# EAGLE design Mic and Speaker for Home Assistant V2.0 (EAGLE 6.1)
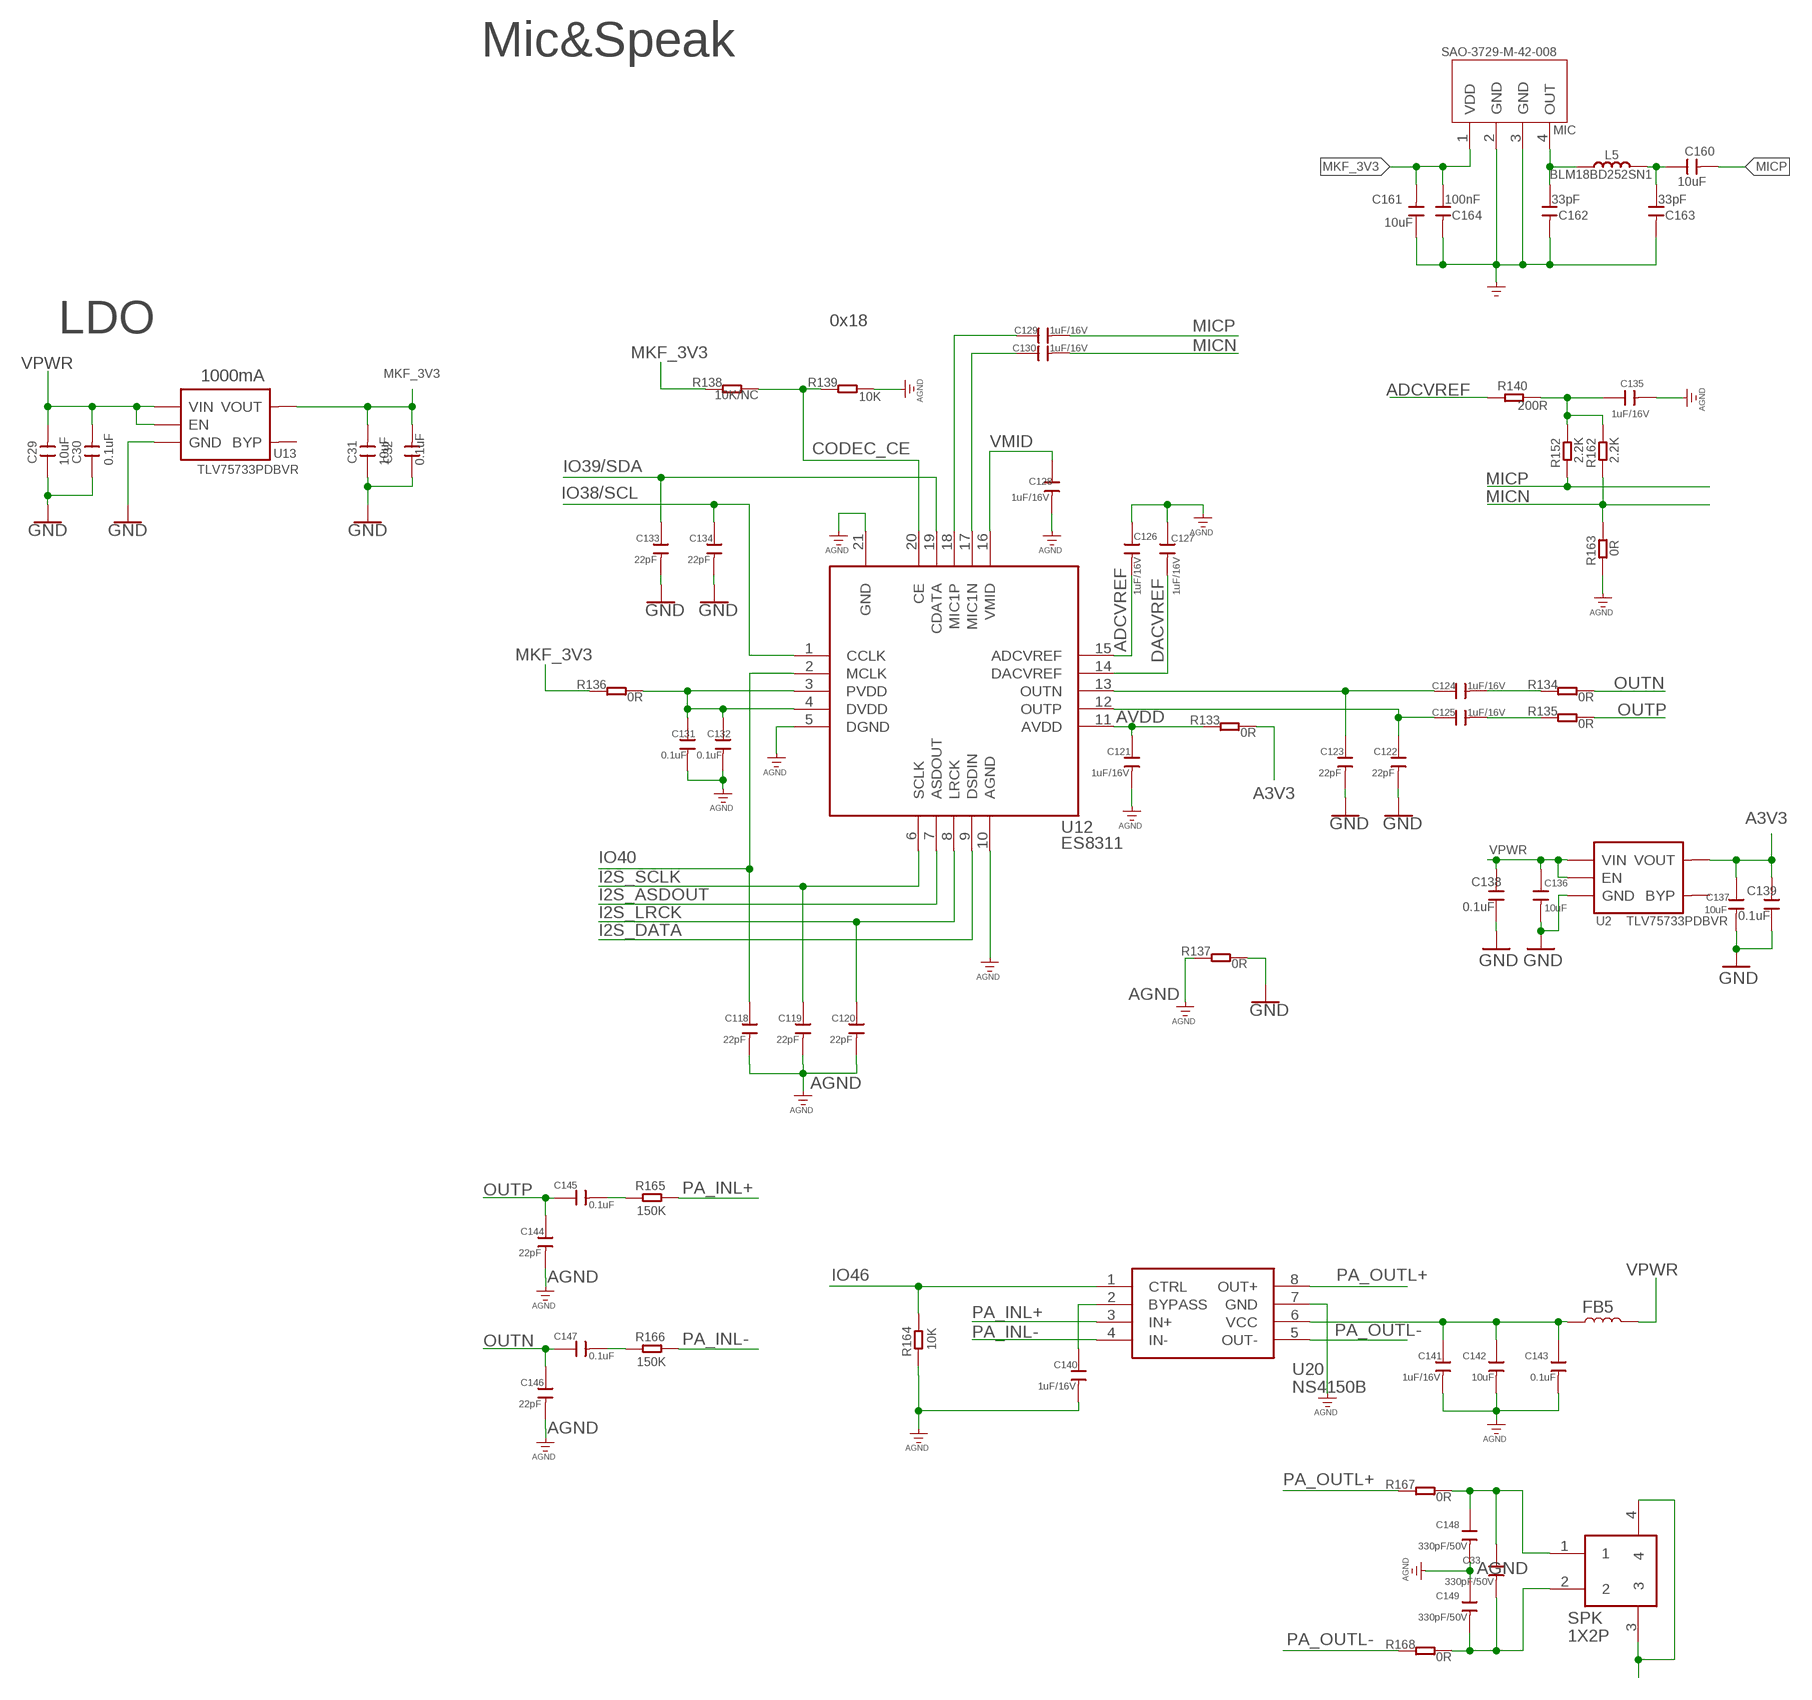
[diagram p0: schematic, sheet 1, part 1 of 2]
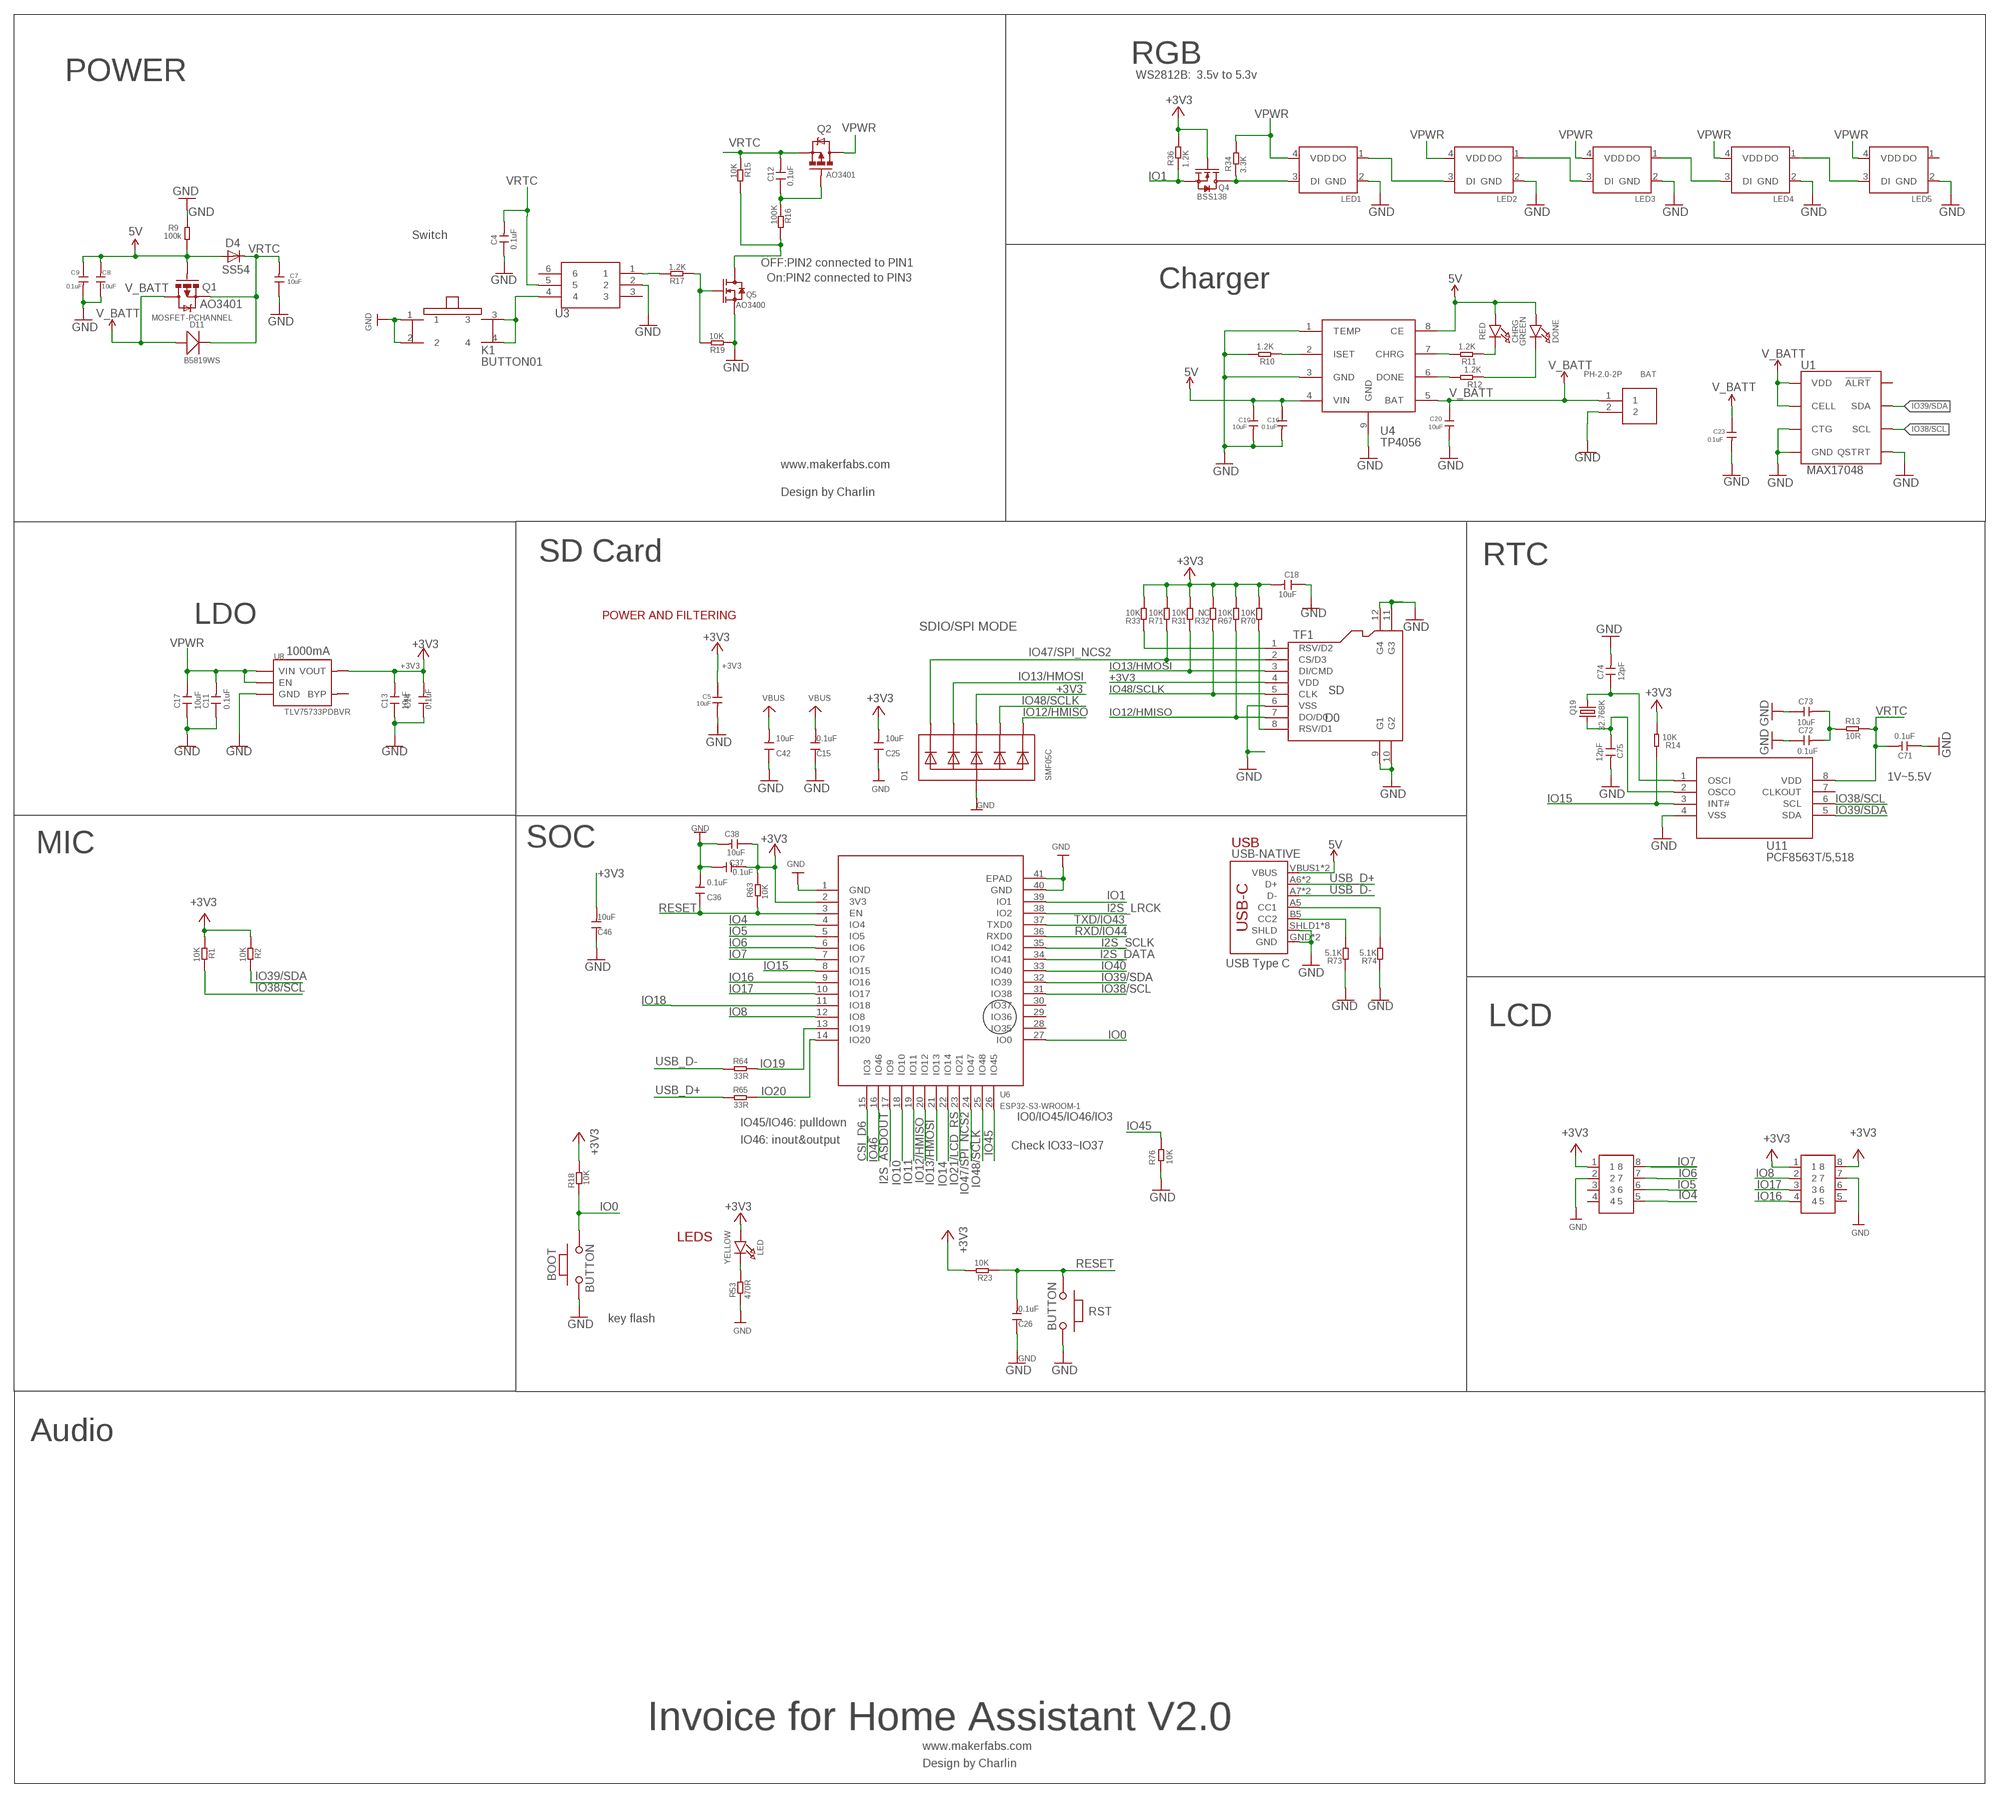
[diagram p1: schematic, sheet 1, part 2 of 2]

## Parts
BAT  PH-2.0-2P  [PH-2.0-2P]
BOOT  BUTTON  PB157  [157SW]
C4  0.1uF  DISCRETE_C-0603  [DISCRETE_C0603]
C5  10uF  C-0603  [C0603]
C7  10uF  C-0603  [C0603]
C8  10uF  C-0603  [C0603]
C9  0.1uF  C-0603  [C0603]
C10  10uF  C-0603  [C0603]
C11  0.1uF  DISCRETE_C-0603  [DISCRETE_C0603]
C12  0.1uF  DISCRETE_C-0603  [DISCRETE_C0603]
C13  10uF  DISCRETE_C-0603  [DISCRETE_C0603]
C14  0.1uF  DISCRETE_C-0603  [DISCRETE_C0603]
C15  0.1uF  DISCRETE_C-0603  [DISCRETE_C0603]
C16  0.1uF  C-0603  [C0603]
C17  10uF  DISCRETE_C-0603  [DISCRETE_C0603]
C18  10uF  DISCRETE_C-0603  [DISCRETE_C0603]
C20  10uF  C-0603  [C0603]
C23  0.1uF  C-0603  [C0603]
C25  10uF  DISCRETE_C-0603  [DISCRETE_C0603]
C26  0.1uF  DISCRETE_C-0603  [DISCRETE_C0603]
C29  10uF  DISCRETE_C-0603  [DISCRETE_C0603]
C30  0.1uF  DISCRETE_C-0603  [DISCRETE_C0603]
C31  10uF  DISCRETE_C-0603  [DISCRETE_C0603]
C32  0.1uF  DISCRETE_C-0603  [DISCRETE_C0603]
C33  330pF/50V  C-0603  [C0603]
C36  0.1uF  DISCRETE_C-0603  [DISCRETE_C0603]
C37  0.1uF  DISCRETE_C-0603  [DISCRETE_C0603]
C38  10uF  DISCRETE_C-0603  [DISCRETE_C0603]
C42  10uF  DISCRETE_C-0603  [DISCRETE_C0603]
C46  10uF  DISCRETE_C-0603  [DISCRETE_C0603]
C71  0.1uF  DISCRETE_C-0603  [DISCRETE_C0603]
C72  0.1uF  DISCRETE_C-0603  [DISCRETE_C0603]
C73  10uF  DISCRETE_C-0603  [DISCRETE_C0603]
C74  12pF  DISCRETE_C-0603  [DISCRETE_C0603]
C75  12pF  DISCRETE_C-0603  [DISCRETE_C0603]
C118  22pF  C-0603  [C0603]
C119  22pF  C-0603  [C0603]
C120  22pF  C-0603  [C0603]
C121  1uF/16V  C-0603  [C0603]
C122  22pF  C-0603  [C0603]
C123  22pF  C-0603  [C0603]
C124  1uF/16V  C-0603  [C0603]
C125  1uF/16V  C-0603  [C0603]
C126  1uF/16V  C-0603  [C0603]
C127  1uF/16V  C-0603  [C0603]
C128  1uF/16V  C-0603  [C0603]
C129  1uF/16V  C-0603  [C0603]
C130  1uF/16V  C-0603  [C0603]
C131  0.1uF  C-0603  [C0603]
C132  0.1uF  C-0603  [C0603]
C133  22pF  C-0603  [C0603]
C134  22pF  C-0603  [C0603]
C135  1uF/16V  C-0603  [C0603]
C136  10uF  C-0603  [C0603]
C137  10uF  C-0603  [C0603]
C138  0.1uF  C-0603  [C0603]
C139  0.1uF  C-0603  [C0603]
C140  1uF/16V  C-0603  [C0603]
C141  1uF/16V  C-0603  [C0603]
C142  10uF  C-0603  [C0603]
C143  0.1uF  C-0603  [C0603]
C144  22pF  C-0603  [C0603]
C145  0.1uF  C-0603  [C0603]
C146  22pF  C-0603  [C0603]
C147  0.1uF  C-0603  [C0603]
C148  330pF/50V  C-0603  [C0603]
C149  330pF/50V  C-0603  [C0603]
C160  10uF  CAP-0603  [C0603]
C161  10uF  CAP-0603  [C0603]
C162  33pF  CAP-0603  [C0603]
C163  33pF  CAP-0603  [C0603]
C164  100nF  CAP-0603  [C0603]
CHRG  RED  LED0805_NOOUTLINE  [CHIPLED_0805_NOOUTLINE]
D1  SMF05C  TVSARRAY_5LANE  [SOT363]
D4  SS54  DIODE-DO-214AC  [DO-214AC]
D11  B5819WS  D'0805'  [SOD323]
DONE  GREEN  LED0805_NOOUTLINE  [CHIPLED_0805_NOOUTLINE]
FB5  INDUCTORFB-30OHM  [0603]
J1  CON2X4-254P-B  [CON2X4-2.54MM-THD]
J2  CON2X4-254P-B  [CON2X4-2.54MM-THD]
K1  BUTTON01  [BUTTON01]
L5  BLM18BD252SN1  INDUCTOR/FERRITE-BEAD'0603'  [L0603]
LED  YELLOW  LED0805_NOOUTLINE  [CHIPLED_0805_NOOUTLINE]
LED1  WS2812B-2020  [WS2812B-2020]
LED2  WS2812B-2020  [WS2812B-2020]
LED3  WS2812B-2020  [WS2812B-2020]
LED4  WS2812B-2020  [WS2812B-2020]
LED5  WS2812B-2020  [WS2812B-2020]
MIC  SAO-3729-M-42-008  MIC-MSM421A3729H8-C  [MIC4-SMD-3.76X2.95MM]
Q1  MOSFET-PCHANNEL  [SOT23-3]
Q2  AO3401  MOSFET-PCHANNEL  [SOT23-3]
Q4  BSS138  MOSFET-N'SOT23'  [SOT23@1]
Q5  AO3400  MOSFET-N'SOT23'  [SOT23@1]
Q19  32.768K  CRYSTAL_3215  [XTAL3215]
R1  10K  R-0603  [R0603]
R2  10K  R-0603  [R0603]
R9  100k  R-0603  [R0603]
R10  1.2K  R-0603  [R0603]
R11  1.2K  R-0603  [R0603]
R12  1.2K  R-0603  [R0603]
R13  10R  R-0603  [R0603]
R14  10K  R-0603  [R0603]
R15  10K  R-0603  [R0603]
R16  100K  R-0603  [R0603]
R17  1.2K  R-0603  [R0603]
R18  10K  R-0603  [R0603]
R19  10K  R-0603  [R0603]
R23  10K  R-0603  [R0603]
R31  10K  DISCRETE_R-0603  [DISCRETE_R0603]
R32  NC  DISCRETE_R-0603  [DISCRETE_R0603]
R33  10K  DISCRETE_R-0603  [DISCRETE_R0603]
R34  3.3K  R-0603  [R0603]
R36  1.2K  R-0603  [R0603]
R53  470R  R-0603  [R0603]
R63  10K  R-0603  [R0603]
R64  33R  R-0603  [R0603]
R65  33R  R-0603  [R0603]
R67  10K  DISCRETE_R-0603  [DISCRETE_R0603]
R70  10K  DISCRETE_R-0603  [DISCRETE_R0603]
R71  10K  DISCRETE_R-0603  [DISCRETE_R0603]
R73  5.1K  DISCRETE_R-0603  [DISCRETE_R0603]
R74  5.1K  DISCRETE_R-0603  [DISCRETE_R0603]
R76  10K  R-0603  [R0603]
R133  0R  R-0603  [R0603]
R134  0R  R-0603  [R0603]
R135  0R  R-0603  [R0603]
R136  0R  R-0603  [R0603]
R137  0R  R-0603  [R0603]
R138  10K/NC  R-0603  [R0603]
R139  10K  R-0603  [R0603]
R140  200R  R-0603  [R0603]
R152  2.2K  R-0603  [R0603]
R162  2.2K  R-0603  [R0603]
R163  0R  R-0603  [R0603]
R164  10K  R-0603  [R0603]
R165  150K  R-0603  [R0603]
R166  150K  R-0603  [R0603]
R167  0R  R-0603  [R0603]
R168  0R  R-0603  [R0603]
RST  BUTTON  PB157  [157SW]
SPK  1X2P  [1X2P-SMT1.25MM]
TF1  SD  HOLDER-MICROSD-8P  [8P-SMD]
U1  MAX17048  MAX17048DFN8  [DFN-8]
U2  TLV75733PDBVR  SPX3819  [SOT23-5]
U3  SW01A  [SOT23-6-95P-300L300W]
U4  TP4056  [SOP8-1.27P]
U6  ESP32-S3-WROOM-1  [ESP32-S3-WROOM-1]
U8  TLV75733PDBVR  SPX3819  [SOT23-5]
U11  PCF8563T/5,518  [SOP8]
U12  ES8311  [QFN20-40P-300L300W55H]
U13  TLV75733PDBVR  SPX3819  [SOT23-5]
U20  NS4150B  [MSOP8-65P-490L300W110H]
USB-NATIVE  USB_C5  [USB-C-16P-5]

## Nets
5V: C8.2 C9.1 C10.1 C16.1 CHRG.A D4.A DONE.A Q1.1(G) R9.1 U4.4(VIN) U4.8(CE) USB-NATIVE.VBUS1(VBUS) USB-NATIVE.VBUS2(VBUS)
+3V3: C5.1 C13.2 C14.2 C18.2 C25.2 C37.1 C38.1 C46.2 D1.4(C3) J1.1 J2.1 J2.8 LED.A Q4.1(G) R1.1 R2.1 R14.1 R18.2 R23.2 R31.2 R32.2 R33.2 R36.2 R63.2 R67.2 R70.2 R71.2 TF1.4(VDD) U6.2(3V3) U8.5(VOUT)
A3V3: C137.1 C139.2 R133.2 U2.5(VOUT)
ADCVREF: C126.2 R140.1 U12.15(ADCVREF)
AGND: C118.2 C119.2 C120.2 C121.2 C126.1 C127.1 C128.2 C131.2 C132.2 C135.2 C140.2 C141.2 C142.2 C143.2 C144.2 C146.2 C148.2 C149.1 C161.1 C162.2 C163.2 C164.2 MIC.2(GND) MIC.3(GND) R137.1 R139.2 R163.1 R164.1 U12.5(DGND) U12.10(AGND) U12.21(GND) U20.7(GND) ; supply symbol labelled GND_POWER
AVDD: C121.1 R133.1 U12.11(AVDD)
CODEC_CE: R138.2 R139.1 U12.20(CE)
CSI_D6: U6.15(IO3)
DACVREF: C127.2 U12.14(DACVREF)
GND: BAT.2 BOOT.1 C4.1 C5.2 C7.1 C8.1 C9.2 C10.2 C11.1 C13.1 C14.1 C15.1 C16.2 C17.1 C18.1 C20.2 C23.2 C25.1 C26.1 C29.1 C30.1 C31.1 C32.1 C36.2 C37.2 C38.2 C42.1 C46.1 C71.1 C72.1 C73.1 C74.2 C75.2 C122.2 C123.2 C133.2 C134.2 C136.2 C137.2 C138.1 C139.1 D1.2(A) J1.2 J2.7 K1.1 K1.2 LED1.2(GND) LED2.2(GND) LED3.2(GND) LED4.2(GND) LED5.2(GND) Q5.2(S) R9.2 R10.2 R19.1 R53.1 R73.1 R74.1 R76.1 R137.2 RST.1 SPK.3 SPK.4 TF1.6(VSS) TF1.9(G1) TF1.10(G2) TF1.11(G3) TF1.12(G4) U1.1(CTG) U1.4(GND) U1.6(QSTRT) U1.9(GND) U2.2(GND) U3.2 U4.1(TEMP) U4.3(GND) U4.9(GND) U6.1(GND) U6.40(GND) U6.41(EPAD) U8.2(GND) U11.4(VSS) U13.2(GND) USB-NATIVE.GND USB-NATIVE.GND2(GND) USB-NATIVE.SHLD1(SHLD) USB-NATIVE.SHLD2(SHLD) USB-NATIVE.SHLD3(SHLD) USB-NATIVE.SHLD4(SHLD) USB-NATIVE.SHLD5(SHLD) USB-NATIVE.SHLD6(SHLD) USB-NATIVE.SHLD7(SHLD) USB-NATIVE.SHLD8(SHLD)
I2S_ASDOUT: U6.17(IO9) U12.7(ASDOUT)
I2S_DATA: U6.34(IO41) U12.9(DSDIN)
I2S_LRCK: C120.1 U6.38(IO2) U12.8(LRCK)
I2S_SCLK: C119.1 U6.35(IO42) U12.6(SCLK)
IO0: BOOT.2 R18.1 U6.27(IO0)
IO1: Q4.2(S) R36.1 U6.39(IO1)
IO4: J1.5 U6.4(IO4)
IO5: J1.6 U6.5(IO5)
IO6: J1.7 U6.6(IO6)
IO7: J1.8 U6.7(IO7)
IO8: J2.2 U6.12(IO8)
IO10: U6.18(IO10)
IO11: U6.19(IO11)
IO12/HMISO: D1.6(C5) R67.1 TF1.7(DO/D0) U6.20(IO12)
IO13/HMOSI: D1.3(C2) R31.1 TF1.3(DI/CMD) U6.21(IO13)
IO14: U6.22(IO14)
IO15: R14.2 U6.8(IO15) U11.3(INT#)
IO16: J2.4 U6.9(IO16)
IO17: J2.3 U6.10(IO17)
IO18: U6.11(IO18)
IO19: R64.2 U6.13(IO19)
IO20: R65.2 U6.14(IO20)
IO21/LCD_RS: U6.23(IO21)
IO38/SCL: C134.1 R1.2 U1.7(SCL) U6.31(IO38) U11.6(SCL) U12.1(CCLK)
IO39/SDA: C133.1 R2.2 U1.8(SDA) U6.32(IO39) U11.5(SDA) U12.19(CDATA)
IO40: C118.1 U6.33(IO40) U12.2(MCLK)
IO45: R76.2 U6.26(IO45)
IO46: R164.2 U6.16(IO46) U20.1(CTRL)
IO47/SPI_NCS2: D1.1(C1) R71.1 TF1.2(CS/D3) U6.24(IO47)
IO48/SCLK: D1.5(C4) R32.1 TF1.5(CLK) U6.25(IO48)
MICN: C130.2 R162.1 R163.2
MICP: C129.2 C160.2 R152.1
MKF_3V3: C31.2 C32.2 C161.2 C164.1 MIC.1(VDD) R136.1 R138.1 U13.5(VOUT)
N$2: R10.1 U4.2(ISET)
N$3: R11.2 U4.7(CHRG)
N$4: R12.2 U4.6(DONE)
N$5: C12.1 Q2.1(G) R16.1
N$6: CHRG.C R11.1
N$7: DONE.C R12.1
N$8: Q5.3(D) R15.2 R16.2
N$12: LED.C R53.2
N$14: LED1.3(DI) Q4.3(D) R34.1
N$15: R33.1 TF1.1(RSV/D2)
N$16: R70.1 TF1.8(RSV/D1)
N$17: K1.3 K1.4 U3.4
N$18: Q5.1(G) R17.1 R19.2
N$19: R17.2 U3.1
N$20: C145.2 R165.1
N$22: LED1.1(DO) LED2.3(DI)
N$24: LED2.1(DO) LED3.3(DI)
N$27: C147.2 R166.1
N$28: C33.2 C149.2 R168.2 SPK.2
N$31: LED3.1(DO) LED4.3(DI)
N$32: LED4.1(DO) LED5.3(DI)
N$33: R74.2 USB-NATIVE.A5(CC1)
N$34: R73.2 USB-NATIVE.B5(CC2)
N$41: C160.1 C163.1 L5.2
N$42: C130.1 U12.17(MIC1N)
N$43: C162.1 L5.1 MIC.4(OUT)
N$45: C122.1 C125.1 U12.12(OUTP)
N$47: C123.1 C124.1 U12.13(OUTN)
N$48: C124.2 R134.1
N$50: C125.2 R135.1
N$51: C129.1 U12.18(MIC1P)
N$52: C131.1 C132.1 R136.2 U12.3(PVDD) U12.4(DVDD)
N$53: C135.1 R140.2 R152.2 R162.2
N$54: C140.1 U20.2(BYPASS)
N$55: C141.1 C142.1 C143.1 FB5.1 U20.6(VCC)
N$56: C74.1 Q19.P$1 U11.1(OSCI)
N$57: C75.1 Q19.P$2 U11.2(OSCO)
N$58: C72.2 C73.2 R13.1
N$59: C33.1 C148.1 R167.2 SPK.1
OUTN: C146.1 C147.1 R134.2
OUTP: C144.1 C145.1 R135.2
PA_INL+: R165.2 U20.3(IN+)
PA_INL-: R166.2 U20.4(IN-)
PA_OUTL+: R167.1 U20.8(OUT+)
PA_OUTL-: R168.1 U20.5(OUT-)
RESET: C26.2 C36.1 R23.1 R63.1 RST.2 U6.3(EN)
RXD/IO44: U6.36(RXD0)
TXD/IO43: U6.37(TXD0)
USB_D+: R65.1 USB-NATIVE.A6(D+) USB-NATIVE.B6(D+)
USB_D-: R64.1 USB-NATIVE.A7(D-) USB-NATIVE.B7(D-)
V_BATT: BAT.1 C20.1 C23.1 D11.+ Q1.3(D) U1.2(CELL) U1.3(VDD) U4.5(BAT)
VMID: C128.1 U12.16(VMID)
VPWR: C11.2 C15.2 C17.2 C29.2 C30.2 C42.2 C136.1 C138.2 FB5.2 LED1.4(VDD) LED2.4(VDD) LED3.4(VDD) LED4.4(VDD) LED5.4(VDD) Q2.3(D) R34.2 U2.1(VIN) U2.3(EN) U8.1(VIN) U8.3(EN) U13.1(VIN) U13.3(EN) ; supply symbol labelled VBUS
VRTC: C4.2 C7.2 C12.2 C71.2 D4.C D11.- Q1.2(S) Q2.2(S) R13.2 R15.1 U3.5 U11.8(VDD)
Unconnected: J1.3 J1.4 J2.5 J2.6 LED5.1(DO) U1.5(!ALRT) U2.4(BYP) U3.3 U3.6 U6.28(IO35) U6.29(IO36) U6.30(IO37) U8.4(BYP) U11.7(CLKOUT) U13.4(BYP)

## Notes on the sheet
- Mic&Speak
- 0x18
- LDO
- 1000mA
- RGB
- POWER | WS2812B:  3.5v to 5.3v
- Switch
- OFF:PIN2 connected to PIN1
- On:PIN2 connected to PIN3
- Charger
- AO3401
- www.makerfabs.com
- Design by Charlin
- SD Card | RTC
- POWER AND FILTERING
- LDO
- SDIO/SPI MODE
- 1000mA
- D0
- 1V~5.5V
- MIC | SOC | USB
- USB Type C
- LCD
- IO0/IO45/IO46/IO3
- IO45/IO46: pulldown
- IO46: inout&output
- Check IO33~IO37
- LEDS
- key flash
- Audio
- Invoice for Home Assistant V2.0
- www.makerfabs.com
- Design by Charlin

## Library data of the parts
BAT = Connector:PH-2.0-2P
BOOT RST = MySMD:PB157
C4 C11-C15 C17 C18 C25 C26 C29-C32 C36-C38 C42 C46 C71-C75 = A9G:DISCRETE_C*: Ceramic Capacitors
C5 C7-C10 C16 C20 C23 C33 C118-C149 = Discrete:C*: Ceramic Capacitors
C160-C164 = Discrete-new:CAP: Ceramic Capacitors
CHRG DONE LED = microbuilder:LED: LED 0603 - 0603 Surface Mount Package 2mA: Green LED - Low Power (3.9mcd, 2ma, 1.7Vf) - Digikey: 475-2709-2-ND Orange LED - Low Power (9.8mcd, 2ma, 1.8Vf) - Digikey: 475-1194-2-ND Red LED - Low Power (5mcd, 2ma, 1.8Vf) - Digikey: 475-1195-2-ND Yellow LED - Low Power (7mcd, 2ma, 1.8Vf) - Digikey: 475-1196-2-ND 5mA: Blue LED - Low Power (17mcd, 5ma, 2.9Vf) - Digikey: LNJ937W8CRACT-ND 0805 - 0805 Surface Mount Package 2mA: Red LED (8.8mcd, 2mA, 1.8Vf, Clear) - Low Power [Digikey: 475-2510-1-ND] Green LED (5mcd, 2mA, 1.8Vf, Clear) - Low Power [Digikey: 475-2730-1-ND] Yellow LED (11.3mcd, 2mA, 1.8Vf, Clear) - Low Power [Digikey: 475-2555-1-ND] 20mA: Red LED (104mcd, 20mA, Diffused) - LS R976 [Digikey: 475-1278-6-ND] Red LED (12mcd, 20mA, 2.0Vf, Clear) - APT2012EC [Digikey: 754-1128-1-ND] Green LED (15mcd, 20mA, 2.2Vf, Clear) - APT2012GC [Digikey: 754-1131-1-ND] Orange LED (160mcd, 20mA, 2.1Vf, Clear) - APT2012SECK [Digikey: 754-1130-1-ND] 1206 - 1206 Surface Mount Package Green LED (26mcd, 20mA, Diffused) - LG N971 [Digikey: 475-1407-6-ND] Red LED (15mcd, 20mA, Diffused) - LH N974 [Digikey: 475-1416-6-ND] Cree - Cree High-Power Surface Mount LEDs XPEBWT-L1-0000-00D50 - White 111lm 350mA 2.9Vf 6200K 110° XTEAWT-00-0000-00000LEE3 - White 114lm 350mA 2.85Vf 5000K 115° Everlight - Everlight 45-21 Series Surface Mount LEDs 45-21/QK2C-B2832AC2CB2/2T - Warm White 2000mcd 20mA 3.25Vf 3050K 120° 45-21/LK2C-B38452C4CB2/2T - Nuetral White 2000mcd 20mA 3.25Vf 4150K 120° 45-21/LK2C-B50634C6CB2/2T - Cold White 2200mcd 20mA 3.25Vf 5650K 120° PLCC2 Reverse Mount LS T77K-J1L2-1-0-2-R18-Z - Red 11.25mcd 2mA 1.8Vf 630nm 120° LO T77K-L1M2-24-Z - Orange 19.6mcd 2mA 1.8Vf 606nm 120° LY T77K-K2M1-26-Z - Yellow 15.7mcd 2mA 1.8Vf 587nm 120°
D1 = microbuilder:TVSARRAY_5LANE: Voltage Transient Suppressor Array SOT363 SMF05C - 100W 5V: Digikey - SMF05CT1GOSCT-ND
D4 = diode:DIODE-: DIODE
D11 = Discrete:D*
FB5 = SparkFun-Coils:INDUCTOR: Inductors Resist changes in electrical current. Basically a coil of wire. SparkFun Products: SparkFun Load Cell Amplifier - HX711 <https://www.sparkfun.com/products/13879> IOIO-OTG - V2.2 <https://www.sparkfun.com/products/13613>; PROD_ID: NDUC-07859
J1 J2 = user:CON2X4-254P-B
K1 = user:BUTTON01
L5 = Discrete-new:INDUCTOR/FERRITE-BEAD
LED1-LED5 = user:WS2812B-2020
MIC = Connector-new:MIC-MSM421A3729H8-C
Q1 Q2 = User-Submitted:MOSFET-PCHANNEL: Generic PMOSFET IRLML2244 - TRANS-11153 (SOT-23 -20V -4.3A) (1.Gate 2.Source 3.Drain) FQP27P06 - COM-10349 <http://www.sparkfun.com/products/10349> (TO-220 -60V -27A) (1.Gate 2.Source 3.Drain); PROD_ID: TRANS-08285
Q4 Q5 = Discrete:MOSFET-N: IRLL014: http://www.vishay.com/docs/91319/sihll014.pdf
Q19 = microbuilder:CRYSTAL: Crystals HC49UP - Surface Mount Crystal 4.0MHz 18pF +/-30ppm Surface Mount Crystal [Digikey: 535-9857-1-ND] 12.0 MHz Surface Mount Crystal [Digikey: 535-9869-6-ND] 25.0 MHz Surface Mount Crystal [Digikey: 535-9078-1-ND] 2.5 x 2.0mm - MEMs SMT Crystal 16.0 MHz 10pF 20ppm 2.5 x 2.0mm Crystal [Digikey -40-85°C: 535-10923-1-ND] 3.2 x 2.5mm - MEMs SMT Crystal 12.0 MHz 8pF 15ppm 3.2 x 2.5mm Crystal [Digikey: -10-70°C: 644-1047-1-ND -40-125°C: 644-1128-1-ND] 40~85°C cheaper: 644-1173-6-ND 16.0 MHz 8pF 15ppm 3.2 x 2.5mm Crystal [Digikey: -10-70°C: 644-1049-1-ND -40-125°C: 644-1129-2-ND]-40~85°C cheaper: 644-1175-6-ND 16.0 MHz 10pF 10ppm 3.2 x 2.5mm Crystal [Digikey: 644-1100-1-ND] 27.12 MHz 18pF 30ppm 3.2 x 2.5mm Crystal [Digikey: 887-1424-1-ND] 27.12MHz 10pF 10ppm 3.2 x 2.5mm Crystal [Digikey: 887-1329-1-ND] 4.9 x 1.8mm - MEMs SMT Crystal 32.768 KHz 12.5pF 20ppm 4.9 x 1.8mm Crystal [Digikey: SE2415CT-ND] 8.0 x 3.8mm - Surface Mount Crystal 32.768kHz 12.5pF 20ppm -40°C-85°C [Digikey: 535-9166-2-ND] Cylinder 32.768KHz Cylinder Crystal (2x6mm body) [Ex. Digikey: 300-8341-2-ND]
R1 R2 R9-R19 R23 R34 R36 R53 R63-R65 R76 R133-R140 R152 R162-R168 = Discrete:R*
R31-R33 R67 R70 R71 R73 R74 = A9G:DISCRETE_R*
SPK = sale:1X2P
TF1 = Connector:HOLDER-MICROSD-8P
U1 = SparkFun-IC-Power:MAX17048: Micropower 1-Cell Li+ ModelGauge SparkFun Products Qduino Mini <https://www.sparkfun.com/products/13614> (DEV-13614); PROD_ID: IC-12551
U2 U8 U13 = IC:SPX3819
U3 = user:SW01A
U4 = self:TP4056
U6 = self:ESP32-S3-WROOM-1
U11 = sale:PCF8563T/5,518
U12 = user:ES8311
U20 = user:NS4150B
USB-NATIVE = USBC:USB_C: USB Type C 16Pin Connector Super Speed pins not available on the 16-pin purely SMD connector so this part is best for USB 2.0 implementations. D1 and D2 are tied together enabling D+/- no matter which way the cable is plugged into the connector. The two channel configuration pins (CC1/2) are exposed. These are normally connected to ground via 5.1k resistors but can be reconfigured for high current/high power applications.

## Net classes
0 default: drill 0.305 mm
1 vbat: width 0.254 mm, drill 0.305 mm, clearance 0.152 mm

## Board
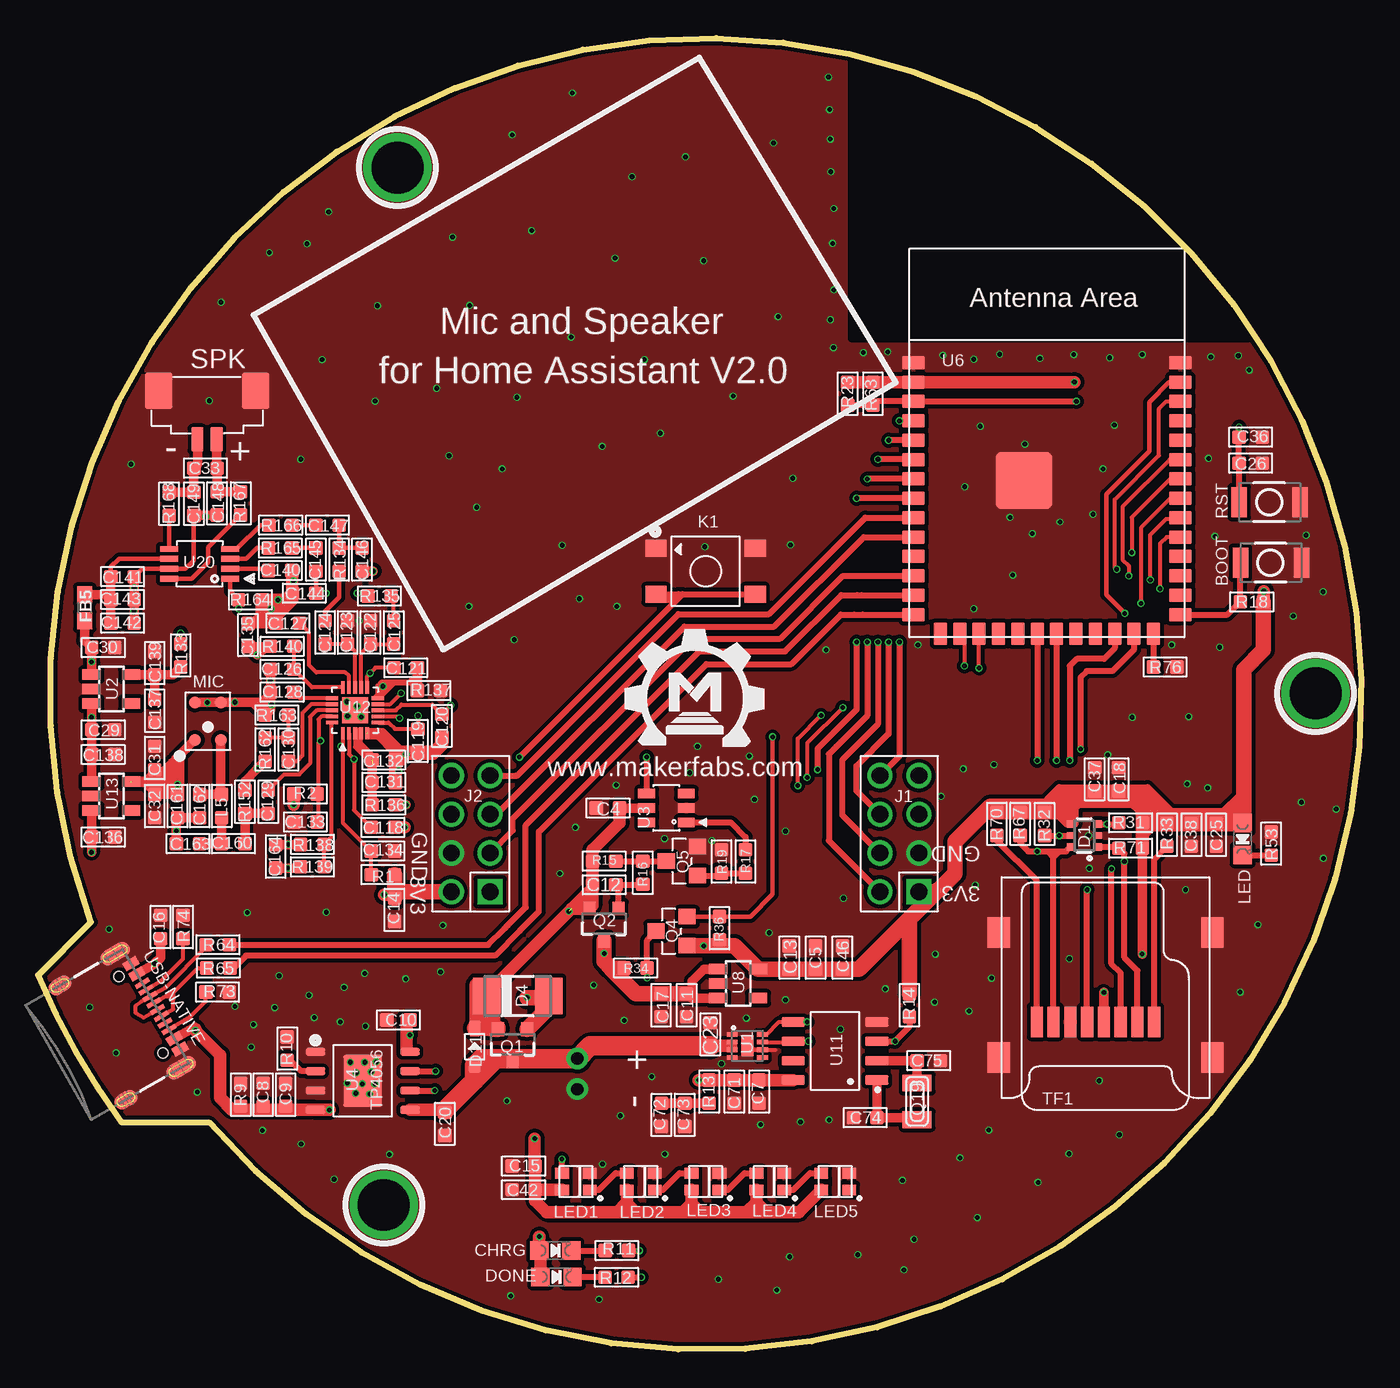
[diagram p2: board, top side]
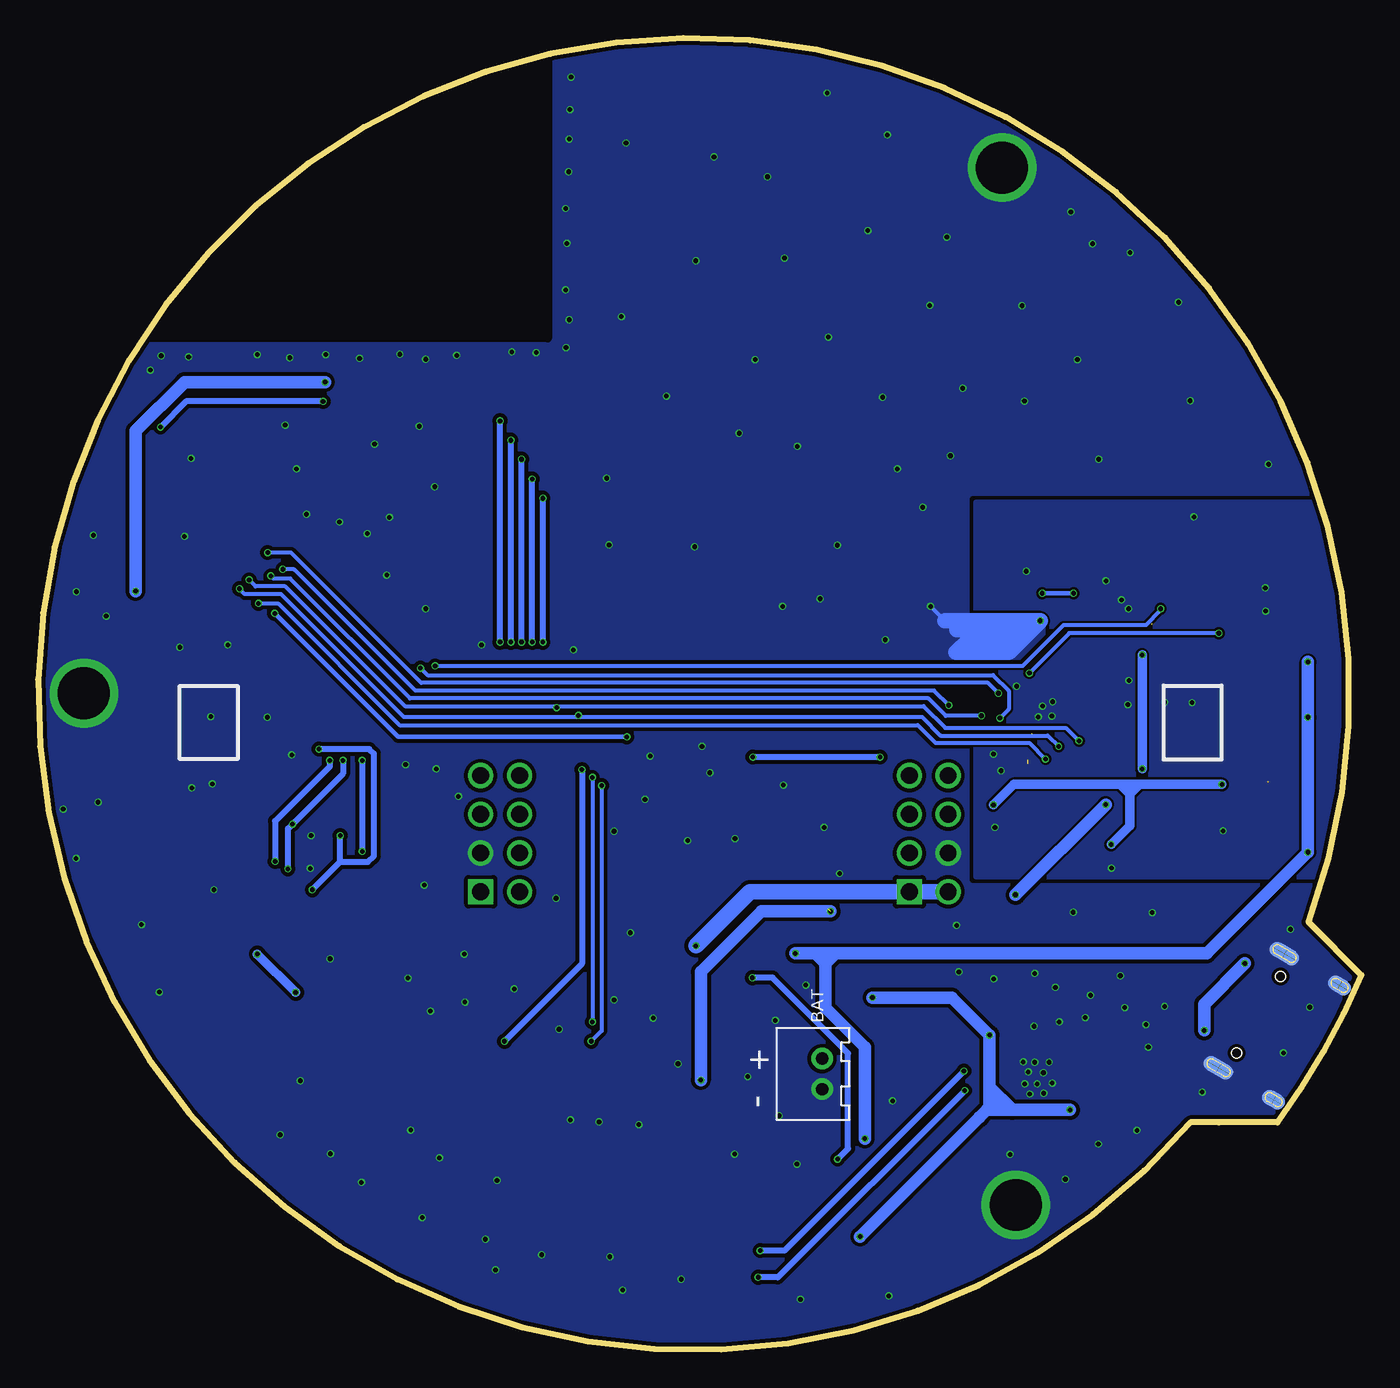
[diagram p3: board, bottom side, seen from below]

Size 86.76 x 85.95 mm. Coordinates in mm from the lower left corner, seen from the top.
Outline: 3.43,27.97 0,24.54 arc13 5.49,14.89 9.32,14.89
Outline: 9.35,14.89 11.2,14.89 arc340 3.45,28.02
Copper layers (1*16): Top 0.035mm / dielectric 1.5mm / Bottom 0.035mm
Design rules: minimum track width 6mil, minimum drill 10mil, track to track 6mil, track to pad 6mil, pad to pad 6mil, via to via 6mil, smd to smd 0mil, copper to edge 10mil, drill to drill 10mil, minimum pad ring 3mil, minimum via ring 3mil, stop-mask expansion 2mil, vias tented up to drill 100mil, thermal gap 0mil
tRestrict: area 53.3,66.3 to 83.1,85.9
bRestrict: area 53.3,66.3 to 83.1,86

### Footprints (pad centres in the part's own frame; a part is rotated, then mirrored left to right if it is on the bottom)
PH-2.0-2P = drill 0.8 pad 1.4: 1 -1,0; 2 1,0
157SW = smd 1.016 x 1.981: 1 0,0; 2 4,0
DISCRETE_C0603 = smd 0.889 x 0.889: 1 -0.762,0; 2 0.762,0
C0603 = smd 0.889 x 0.889: 1 -0.762,0; 2 0.762,0
C0603' = smd 0.889 x 0.889: 1 0,0.762; 2 0,-0.762
CHIPLED_0805_NOOUTLINE = smd 1.2 x 1.2: A 0,-1.05; C 0,1.05
SOT363 = smd 0.5 x 0.5: 1 -0.75,-0.9; 3 0.75,-0.9; 4 0.75,0.9; 6 -0.75,0.9 | smd 0.4 x 0.5: 2 0,-0.9; 5 0,0.9
DO-214AC = smd 1.8 x 2.4: A 2.025,0; C -2.025,0
SOD323 = smd 1 x 0.8: + -1.2,0; - 1.2,0
0603 = smd 1.1 x 1: 1 -0.85,0; 2 0.85,0
CON2X4-2.54MM-THD = drill 1.1 square: 1 -3.81,-1.27 | drill 1.1: 2 -1.27,-1.27; 3 1.27,-1.27; 4 3.81,-1.27; 5 3.81,1.27; 6 1.27,1.27; 7 -1.27,1.27; 8 -3.81,1.27
BUTTON01 = smd 1.4 x 1.1: 1 -3.25,1.5; 2 3.25,1.5; 3 -3.25,-1.5; 4 3.25,-1.5
L0603 = smd 0.889 x 0.889: 1 -0.762,0; 2 0.762,0
WS2812B-2020 = smd 0.9 x 0.7: 1 -0.915,0.55; 2 -0.915,-0.55; 3 0.915,-0.55; 4 0.915,0.55
MIC4-SMD-3.76X2.95MM = smd 0.8 x 0.8: 1 0.85,1.23; 2 0.85,-1.23; 3 -0.85,-1.23; 4 -0.85,1.23
SOT23-3 = smd 0.8 x 0.9: 1 -0.95,-1; 2 0.95,-1; 3 0,1.1
SOT23@1 = smd 1.016 x 1.143: 1 -0.95,-1.016; 2 0.95,-1.016; 3 0,1.016
XTAL3215 = smd 1.1 x 1.9: P$1 1.2,0; P$2 -1.2,0
R0603 = smd 0.889 x 0.889: 1 -0.762,0; 2 0.762,0
DISCRETE_R0603 = smd 0.889 x 0.889: 1 -0.762,0; 2 0.762,0
1X2P-SMT1.25MM = smd 0.8 x 1.6: 1 -0.625,0; 2 0.625,0 | smd 1.8 x 2.4: 3 3.175,-3.2; 4 -3.175,-3.2
8P-SMD = smd 0.8 x 2.008: 1 -3.198,0.254; 2 -2.098,0.254; 3 -0.998,0.254; 4 0.102,0.254; 5 1.202,0.254; 6 2.302,0.254; 7 3.402,0.254; 8 4.502,0.254 | smd 1.45 x 2: 9 -7.002,2.6; 10 7.002,2.6; 11 -7.002,-5.598; 12 7.002,-5.598
DFN-8 = smd 0.3 x 0.7: 1 -0.75,-0.99; 2 -0.25,-0.99; 3 0.25,-0.99; 4 0.75,-0.99; 5 0.75,0.99; 6 0.25,0.99; 7 -0.25,0.99; 8 -0.75,0.99 | smd 1.38 x 0.8: 9 0,0
SOT23-5 = smd 0.69 x 1.2: 1 -0.95,-1.3; 2 0,-1.3; 3 0.95,-1.3; 4 0.95,1.3; 5 -0.95,1.3
SOT23-6-95P-300L300W = smd 1.1 x 0.6: 1 -1.3,0.95; 2 -1.3,0; 3 -1.3,-0.95; 4 1.3,-0.95; 5 1.3,0; 6 1.3,0.95
SOP8-1.27P = smd 1.27 x 0.51: 1 -3.1,1.905; 2 -3.1,0.635; 3 -3.1,-0.635; 4 -3.1,-1.905; 5 3.1,-1.905; 6 3.1,-0.635; 7 3.1,0.635; 8 3.1,1.905 | smd 2.5 x 3.4: 9 0,0
ESP32-S3-WROOM-1 = smd 1.5 x 0.9: 1 -8.75,5.26; 2 -8.75,3.99; 3 -8.75,2.72; 4 -8.75,1.45; 5 -8.75,0.18; 6 -8.75,-1.09; 7 -8.75,-2.36; 8 -8.75,-3.63; 9 -8.75,-4.9; 10 -8.75,-6.17; 11 -8.75,-7.44; 12 -8.75,-8.71; 13 -8.75,-9.98; 14 -8.75,-11.25; 27 8.75,-11.25; 28 8.75,-9.98; 29 8.75,-8.71; 30 8.75,-7.44; 31 8.75,-6.17; 32 8.75,-4.9; 33 8.75,-3.63; 34 8.75,-2.36; 35 8.75,-1.09; 36 8.75,0.18; 37 8.75,1.45; 38 8.75,2.72; 39 8.75,3.99; 40 8.75,5.26 | smd 0.9 x 1.5: 15 -6.985,-12.5; 16 -5.715,-12.5; 17 -4.445,-12.5; 18 -3.175,-12.5; 19 -1.905,-12.5; 20 -0.635,-12.5; 21 0.635,-12.5; 22 1.905,-12.5; 23 3.175,-12.5; 24 4.445,-12.5; 25 5.715,-12.5; 26 6.985,-12.5 | smd 3.7 x 3.7: 41 -1.5,-2.46
SOP8 = smd 1.52 x 0.6: 1 -2.74,1.905; 2 -2.74,0.635; 3 -2.74,-0.635; 4 -2.74,-1.905; 5 2.74,-1.905; 6 2.74,-0.635; 7 2.74,0.635; 8 2.74,1.905
QFN20-40P-300L300W55H = smd 0.8 x 0.25: 1 -1.5,0.8; 2 -1.5,0.4; 3 -1.5,0; 4 -1.5,-0.4; 5 -1.5,-0.8; 11 1.5,-0.8; 12 1.5,-0.4; 13 1.5,0; 14 1.5,0.4; 15 1.5,0.8 | smd 0.25 x 0.8: 6 -0.8,-1.5; 7 -0.4,-1.5; 8 0,-1.5; 9 0.4,-1.5; 10 0.8,-1.5; 16 0.8,1.5; 17 0.4,1.5; 18 0,1.5; 19 -0.4,1.5; 20 -0.8,1.5 | smd 1.7 x 1.7: 21 0,0
MSOP8-65P-490L300W110H = smd 1.2 x 0.38: 1 -2,0.975; 2 -2,0.325; 3 -2,-0.325; 4 -2,-0.975; 5 2,-0.975; 6 2,-0.325; 7 2,0.325; 8 2,0.975
USB-C-16P-5 = smd 0.3 x 1: A5 -1.25,-0.34; A6 -0.25,-0.34; A7 0.25,-0.34; A8 1.25,-0.34; B5 1.75,-0.34; B6 0.75,-0.34; B7 -0.75,-0.34; B8 -1.75,-0.34 | smd 0.6 x 1: GND -3.225,-0.34; GND2 3.225,-0.34; VBUS1 -2.45,-0.34; VBUS2 2.45,-0.34 | smd 1 x 2.1: SHLD1 -4.32,-0.915; SHLD2 4.32,-0.915 | smd 1 x 2.1 bottom: SHLD3 -4.32,-0.915; SHLD4 4.32,-0.915 | smd 1 x 1.6: SHLD5 -4.32,-5.095; SHLD8 4.32,-5.095 | smd 1 x 1.6 bottom: SHLD6 -4.32,-5.095; SHLD7 4.32,-5.095 | hole 0.65: -2.89,-1.445; 2.89,-1.445

### Placement (x,y rotation side)
BAT  35.36,18.07 270 bottom
BOOT  82.83,51.57 180 top
C4  37.36,35.49 0 top
C5  50.97,25.69 90 top
C7  47.27,16.9 90 top
C8  14.76,16.7 270 top
C9  16.23,16.7 90 top
C10  23.62,21.6 180 top
C11  42.52,22.56 90 top
C12  37.11,30.46 180 top
C13  49.25,25.69 270 top
C14  23.37,28.81 90 top
C15  31.83,12.02 0 top
C16  8.03,27.69 90 top
C17  40.84,22.56 90 top
C18  70.84,37.37 270 top
C20  26.67,14.79 270 top
C23  44.07,20.66 90 top
C25  77.24,33.74 90 top
C26  79.5,58.1 180 top
C29  4.27,40.62 180 top
C30  4.27,46.01 180 top
C31  7.65,38.77 270 top
C32  7.65,35.62 90 top
C33  10.97,57.77 180 top
C36  79.5,59.8 0 top
C37  69.27,37.37 90 top
C38  75.62,33.74 270 top
C42  31.83,10.47 0 top
C46  52.73,25.69 270 top
C71  45.64,16.9 90 top
C72  40.87,15.37 90 top
C73  42.39,15.37 90 top
C74  54.23,15.2 180 top
C75  58.39,18.93 0 top
C118  22.61,34.22 0 top
C119  24.89,39.89 270 top
C120  26.47,40.88 270 top
C121  24.1,44.69 0 top
C122  21.79,47 90 top
C123  20.29,47 90 top
C124  18.82,47 90 top
C125  23.32,47 90 top
C126  16,44.58 0 top
C127  16.38,47.61 0 top
C128  16,43.09 180 top
C129  15.09,35.9 270 top
C130  16.41,39.33 90 top
C131  22.66,37.17 0 top
C132  22.66,38.64 0 top
C133  17.53,34.58 180 top
C134  22.61,32.67 0 top
C135  13.77,46.82 90 top
C136  4.27,33.59 0 top
C137  7.65,41.87 270 top
C138  4.27,39 180 top
C139  7.65,44.99 270 top
C140  15.88,51.06 0 top
C141  5.54,50.66 0 top
C142  5.54,47.61 0 top
C143  5.54,49.16 0 top
C144  17.45,49.56 180 top
C145  18.21,51.77 90 top
C146  21.23,51.77 270 top
C147  18.97,54.03 180 top
C148  11.73,55.46 270 top
C149  10.21,55.43 90 top
C160  10uF  [C0603']  12.8,33.15 90 top
C161  10uF  [C0603']  9.14,35.62 180 top
C162  33pF  [C0603']  10.59,35.62 0 top
C163  33pF  [C0603']  9.83,33.15 270 top
C164  100nF  [C0603']  15.57,32.32 0 top
CHRG  33.91,6.48 270 top
D1  68.59,33.69 90 top
D4  31.45,23.17 0 top
D11  28.63,19.84 90 top
DONE  33.99,4.76 270 top
FB5  3.05,48.62 270 top
J1  56.47,33.81 90 top
J2  28.36,33.81 90 top
K1  43.76,51.01 0 top
L5  12.04,35.62 270 top
LED  78.97,33.46 180 top
LED1  35.26,11.01 180 top
LED2  39.51,11.01 180 top
LED3  43.76,11.01 180 top
LED4  48.01,11.01 180 top
LED5  52.26,11.01 180 top
MIC  11.13,41.18 180 top
Q1  31.12,20 180 top
Q2  37.11,27.9 180 top
Q4  41.53,27.41 90 top
Q5  42.21,32.01 90 top
Q19  57.63,16.26 270 top
R1  22.61,31.12 180 top
R2  17.53,36.41 0 top
R9  13.28,16.7 90 top
R10  16.33,19.72 90 top
R11  37.95,6.48 0 top
R12  37.92,4.73 0 top
R13  43.99,16.9 90 top
R14  57.12,22.56 270 top
R15  37.11,32.01 0 top
R16  39.65,31.25 90 top
R17  46.38,31.99 90 top
R18  79.58,49 0 top
R19  44.81,31.99 270 top
R23  53.09,62.64 90 top
R31  71.63,34.53 0 top
R32  65.99,34.45 90 top
R33  74.02,33.74 90 top
R34  39.17,25 180 top
R36  44.68,27.62 270 top
R53  80.85,33.15 270 top
R63  54.74,62.64 90 top
R64  11.79,26.53 0 top
R65  11.81,25 0 top
R67  64.39,34.45 90 top
R70  62.87,34.45 90 top
R71  71.63,32.85 0 top
R73  11.76,23.43 180 top
R74  9.5,27.69 270 top
R76  73.89,44.74 180 top
R133  9.35,45.5 270 top
R134  19.74,51.77 90 top
R135  22.38,49.39 180 top
R136  22.66,35.69 180 top
R137  25.63,43.19 0 top
R138  17.98,33.1 0 top
R139  17.98,31.63 180 top
R140  16,46.08 180 top
R152  13.56,35.9 90 top
R162  14.88,39.33 270 top
R163  15.65,41.59 0 top
R164  13.92,49.13 180 top
R165  15.88,52.53 180 top
R166  15.9,54.03 180 top
R167  13.28,55.46 90 top
R168  8.59,55.43 90 top
RST  82.75,55.53 180 top
SPK  11.07,59.65 180 top
TF1  69.98,21.72 180 top
U1  46.51,19.9 270 top
U2  4.8,43.29 270 top
U3  41.2,35.49 180 top
U4  21.29,17.61 0 top
U6  66.14,59.42 0 top
U8  45.9,23.99 270 top
U11  52.25,19.57 180 top
U12  20.78,41.89 90 top
U13  4.8,36.28 270 top
U20  10.59,51.49 180 top
U$1  [MAKERFABS_0.3]  38.94,39.59 0 top
USB-NATIVE  8,22.66 300 top

### Tracks (layer width: path | path; a pad name or v marks a point on that pad's centre or on a via)
5V  (via drill 0.3)
  Top 0.254: U4.8 24.16,19.51 24.08,19.59 | v7.64,25.31 7.72,25.31 7.87,25.46 7.87,26.7 8.08,26.91 | R9.1 13.28,15.76 13.26,15.73 | 13.34,15.7 14.53,15.7 C8.2 C9.1
  Top 0.406: U4.8 v24.38,20.61 C10.1 | 19.13,15.68 v19.1,15.7 | 32.94,6.34 32.84,6.43 32.84,6.47 CHRG.A
  Top 0.61: USB-NATIVE.VBUS1 7.6,25.26 v7.64,25.31 8.03,25.69 C16.1 | 24.08,19.59 24.08,19.62 24.05,19.64 24.05,21.72 | USB-NATIVE.VBUS2 10.21,21.09 arc-171 10.36,20.86
  Top 0.813: v19.1,15.7 U4.4 13.34,15.7 13.34,15.73 13.26,15.73 12.7,15.73 11.94,16.49 11.94,19.29 10.36,20.86 v10.31,20.91 | DONE.A 32.94,6.34 | CHRG.A 32.86,7.39 v32.87,7.4
  Top 1.016: D4.A 33.47,22.4 Q1.1 33.22,22.16 33.22,23.07 v32.05,23.07
  Bottom 0.813: v19.1,15.7 22.89,15.7 | 24.38,17.2 v24.38,20.61 26.85,23.07 v32.05,23.07 | v10.31,20.91 10.31,22.64 v7.64,25.31 | 22.89,15.7 24.38,17.2 | v32.87,7.4 25.04,15.22 24.56,15.7 | 24.56,15.7 24.38,15.88 24.38,17.2 | 22.89,15.7 24.56,15.7 | 24.56,15.7 24.23,16.03 23.65,16.03
+3V3  (via drill 0.3)
  Top 0.254: 67.44,34.4 67.65,34.4 D1.4 | R36.2 44.68,26.62 44.83,26.46 | v43.64,26.45 44.31,26.45 44.32,26.46 | 73.05,34.12 72.8,34.12 R31.2 | 74.09,34.91 74.09,35.11 74.3,35.31
  Top 0.406: R71.2 R31.2 | 72.42,34.55 R31.2 | R31.2 73.03,34.53 73.99,34.53 R33.2 C38.1 C25.2 78.96,34.5 LED.A | R70.2 R67.2 R32.2 67.39,36.61 67.67,36.61 | 67.67,36.61 C37.1 C18.2 | D1.4 67.69,36.59 67.67,36.61 | 66.14,36.08 66.93,36.86 72.75,36.86 74.3,35.31 77.72,35.31 78.72,36.3 | 79.35,36.94 79.35,34.12 73.05,34.12 72.62,33.69 72.62,32.6 72.16,32.6 72.16,35.26 71.68,35.75 68.3,35.75 68,35.44 68,34.4 67.44,34.4 66.93,34.91 62.38,34.91 | 58.92,30 59.08,30 59.08,30.18
  Top 0.61: TF1.4 v69.88,23.4 | v72.39,25.92 R71.2 | v67.94,63.41 v67.95,63.41 | 80.37,49.03 R18.2
  Top 0.813: R23.2 R63.2 U6.2 v67.94,63.41 | 80.37,49.03 v80.37,49.71 | 73.33,35.67 73.56,35.67 | 49.24,24.94 C13.2 | R2.1 v16.76,35.72 | v22.68,29.8 23.14,29.8 C14.2
  Top 1.016: 67.23,35.29 67.08,35.44 67.08,36.33 66.37,35.62 62.43,35.62 60.1,33.28 60.1,31.17 58.92,30 J1.1 | 67.51,35.01 67.23,35.29 | 67.23,35.29 66.4,35.29 67.11,36 72.8,36 72.77,35.97 72.77,34.3 73.33,34.86 73.33,35.67 | 73.33,35.67 74.09,34.91 78.94,34.91 78.59,35.26 78.59,35.62 79.05,35.62 79.05,44.56 80.34,45.85 R18.2 | C14.2 23.37,30.23 | 23.37,30.23 R1.1 | J2.8 23.6,30 23.37,30.23 | 73.33,35.67 72.72,36.28 71.93,36.28 | 71.42,36.28 71.93,36.28 | 71.93,36.28 72.95,35.26 72.95,34.6 73.03,34.53 | Q4.1 44.32,26.46 44.83,26.46 45.67,26.46 U8.5 49.24,24.94 | C13.2 C5.1 C46.2 53.82,24.92 57.12,28.23 | 57.12,28.23 59.08,30.18 | R14.1 57.12,28.23
  Bottom 0.61: v69.88,23.4 v72.39,25.92
  Bottom 0.813: v67.95,63.41 77.17,63.41 80.37,60.21 v80.37,49.71 | v16.76,35.72 v22.68,29.8
  Bottom 1.016: 29.69,30 29.68,30 | 29.68,30 J2.1 J2.8 | 29.68,30 40.09,30 v43.64,26.45
A3V3
  Top 0.61: U2.5 7.63,44.24 C139.2 | C137.1 C139.2 | C139.2 8.84,44.23 R133.2
ADCVREF
  Top 0.254: R140.1 C126.2 17.96,43.39 U12.15
AGND  (via drill 0.3)  (2 unrouted)
  Top 0.254: R139.2 17.14,31.55 17.22,31.55 17.25,31.53 16.41,31.53 v16.38,31.55 | U12.5 22.3,40.39 23.42,39.28 23.42,39.15 | 23.42,39.15 C132.2 C131.2 | 24.13,39.12 C119.2 26.04,39.12 C120.2 | 24.13,39.12 23.44,39.12 23.42,39.15 | 15.13,42.41 15.24,42.3 | U12.10 22.84,43.26 | 22.84,43.26 23.33,43.75 24.87,43.75 | v11.1,42.4 10.29,42.4 MIC.2 | U12.21 20.78,42.04 v20.9,42.17 | v22.61,43.47 22.63,43.47 22.84,43.26 | v24.13,39.02 24.13,39.12 | 21.59,40.11 22.23,40.11 23.11,39.23 23.11,37.45 23.72,37.45 23.72,38.23 24.28,38.79 26.04,38.79 26.77,39.53 26.77,40.27 26.16,40.27 26.16,39.78 25.81,39.43 23.8,39.43 22.66,40.57 21.59,40.57 21.59,40.37 21.67,40.29 22.4,40.29 22.53,40.42 23.65,39.3 25.91,39.3 26.24,39.63 26.59,39.63 25.88,38.92 23.88,38.92 23.62,39.17 23.27,39.17 23.27,37.52 23.57,37.52 23.57,38.34 24.05,38.82 | 22.02,42.7 22.25,42.93 22.25,43.52 22.53,43.8 24.33,43.8 24.82,44.28 24.82,43.26 | 24.82,43.26 24.43,43.64 23.34,43.64 22.45,42.76 | 22.43,42.73 22.45,42.76 | 22.45,42.76 22.45,43.49 22.55,43.59 23.04,43.59 22.71,43.26 22.58,43.26 | R137.1 24.87,43.21 24.82,43.26
  Top 0.305: C149.1 10.19,54.64 10.19,51.7 9.66,51.17 U20.7 6.81,51.17 C141.2 | 9.07,34.78 C161.1
  Top 0.406: 13.69,47.56 13.87,47.56 14.45,48.14 14.45,49.36 16.15,49.36 16.46,49.66 16.46,50.88 16.87,50.88 16.87,49.05 15.7,47.89 14.96,47.89 15.11,48.04 15.11,48.72 16.28,48.72 15.72,48.17 15.27,48.17 15.27,48.45 15.85,48.45
  Top 0.61: C149.1 11.71,54.67 C148.2 | C163.2 v9.07,33.99 9.07,34.78 | C162.2 C161.1 | MIC.2 MIC.3 15.13,42.41 | C142.2 C143.2 v6.3,49.92 C141.2 | C146.2 v21.97,51.01 | C126.1 v15.24,43.85 C128.2 15.24,43.01 | C164.2 v16.38,31.55 17.14,31.55 | 15.24,42.43 15.24,42.3 15.24,41.94 R163.1 | C135.2 14.73,47.58 | 14.73,47.58 15.6,47.58 C127.1 | 14.73,47.58 14.68,47.63 R164.1 v15.72,49.13 16.26,49.13 C144.2 16.64,49.61 C140.2 | C121.2 24.87,43.75 R137.1 | 14.91,41.59 14.1,42.4 14.63,42.4 15.24,43.01 | 15.24,43.01 15.24,42.43 | 15.24,42.43 14.83,42.02
  Top 0.813: C118.2 v24.03,34.22
  other vias: 10.97,54.57 20.24,42.45 20.29,41.51 21.18,41.46 15.27,48.55 16.74,50.38 6.27,48.39 15.32,42.27 12.9,42.43 23.62,37.93
  pour Bottom: 0.76,55.51 25.26,55.51 25.26,31.01 0.76,31.01
AVDD  (via drill 0.3)
  Top 0.254: U12.11 21.58,44.14 v21.77,44.33 22.12,44.69 C121.1 | R133.1 v9.35,46.95
  Bottom 0.254: v9.35,46.95 19.15,46.95 v21.77,44.33
CODEC_CE
  Top 0.254: R139.1 R138.2 19.2,33.56 19.2,41.02 U12.20
DACVREF
  Top 0.254: U12.14 20.38,44.15 20.14,44.38 18.24,44.38 17.75,44.86 17.75,47 C127.2
GND  (via drill 0.3, 3.4 pad 4.5)
  Top 0.254: U1.9 46.76,19.64 48.34,19.64 | U1.6 46.76,19.65
  Top 0.406: 46.76,19.65 U1.9
  Bottom 0.254: 27.3,47.76 v28.25,48.7
  Bottom 1.016: 27.3,47.76 v21.06,47.76 23.11,45.7 26.57,45.7 25.81,46.46 23.32,46.46 22.61,47.18 26.52,47.18
  other vias: 22.66,9.47 83.76,43.01 23.56,77.47 18.11,21.75 82.83,35.87 61.34,48.55 59.21,36.25 44.17,33.36 58.83,25.92 42.72,37.8 37.9,36.99 47.93,27.31 46.96,36.05 43.23,39.53 62.66,38.34 74.32,46.18 75.34,37.07 76.68,36.81 70.13,38.97 85.12,35.42 79.98,27.85 78.82,23.43 67.61,25.61 68.86,33.69 68.91,31.53 69.57,17.61 49.28,6.08 53.75,6.21 70.89,14.08 17.25,13.47 56.77,5.21 62.33,14.38 61.57,8.64 26.39,24.75 14.12,21.29 3.38,22.44 5.11,19.44 10.44,16.87 14.71,14.36 20.47,18.83 21.41,18.83 22.17,18.85 21.84,18.19 20.85,18.14 20.27,17.46 21.26,17.41 22.07,17.41 21.74,16.75 20.83,16.8 19.81,21.47 21.46,21.19 15.52,22.41 21.41,24.65 35.03,82.35 26.95,58.58 13.97,19.82 4.65,27.54 36.98,59.19 32.36,73.34 18.62,64.88 45.57,62.49 26.14,63 35.48,49.21 42.44,78.16 30.43,57.72 15.16,71.89 11.99,68.64 19.05,74.56 40.79,60.05 22.25,68.41 37.82,71.53 48.21,79.08 38.94,76.87 28.3,68.44 60.76,56.55 63.91,50.76 67.01,54.24 70.56,60.59 71.73,41.43 65.18,53.47 63.73,54.54 51.87,15.04 49.33,52.74 49.48,57.11 31.39,62.42 48.51,67.7 46.43,21.72 49,22.92 47.37,14.74 49.99,14.92 43.71,52.61 34.37,52.71 43.64,71.36 28.75,55.2 79.4,64.19 70.26,65.01 65.68,64.96 61.34,64.9 34.95,66.35 83.13,53.37 84.25,49.66 82.3,48.06 75.23,30.13 61.44,30.44 61.04,22.18 44.6,4.6 65.56,10.95 60.45,12.56 30.99,3.51 56.67,11.08 57.43,7.22 48.44,3.89 36.78,3.28 23.04,12.78 19.41,11.16 17.75,23.22 20.07,23.73 15.8,24.49 34.21,31.2 12.9,22.49 37.01,12.15 41.1,12.81 69.82,57.72 64.69,59.34 69.16,54.74 61.77,60.51 39.75,64.88 44.81,18.73 24.1,24.29 36.42,23.88 31.09,79.61 17.63,72.47 67.59,12.83 84.28,32.19 51.82,83.4 51.89,81.26 51.94,79.33 51.97,77.2 52.17,74.79 52.1,72.5 52.17,69.45 51.94,67.5 52.15,65.67 54.1,65.34 55.7,65.39 59.31,65.16 63.04,65.23 67.89,65.21 72.39,65.21 76.89,65.06 78.69,65.13 51.66,45.85 57.68,46.18 46.63,38.89 52.81,29.57 13.72,28.63 18.9,28.66 26.54,27.8 52.6,20.99 62.51,24.34 58.78,22.77 55.55,23.63 41.07,33.48 35.23,34.22 49,33.97 60.66,38.06 75.44,41.49 77.47,46.03 6.1,58.02 11.23,62.19 17.22,58.35 22.1,62.16 27.18,72.91 76.73,58.4 77.17,53.3 31.22,46.51 37.95,48.7 30.73,16.29 38.18,15.32 38.43,21.57 40.23,17.89
  pour Top (isolate 0.254, rank 6): -6.24,100.01 -6.24,-9.99 120.76,-9.99 120.76,100.01
  pour Bottom (isolate 0.254, rank 6): -7.24,-4.99 120.76,-4.99 120.76,100.01 -7.24,100.01
I2S_ASDOUT  (via drill 0.3)
  Top 0.254: v61.7,44.66 U6.17 | U12.7 23.59,41.49 v23.7,41.38
  Bottom 0.254: v23.7,41.38 23.11,41.97 23.11,43.16 24.16,44.2 61.24,44.2 v61.7,44.66
I2S_DATA  (via drill 0.3)
  Top 0.254: U12.9 23.08,42.29 v23.8,43.01 | U6.34 74.22,57.06 71.7,54.54 v71.7,52.23
  Bottom 0.254: v23.8,43.01 24.49,43.7 61.65,43.7 70.18,52.23 v71.7,52.23
I2S_LRCK  (via drill 0.3)
  Top 0.254: v27.05,42.22 C120.1 25.83,42.27 23.82,42.27 23.44,41.89 U12.8 | U6.38 73.97,62.14 73.48,61.65 73.48,58.61 70.59,55.71 70.59,51.26 v70.71,51.14
  Bottom 0.254: v27.05,42.22 28.02,43.19 62.03,43.19 69.98,51.14 v70.71,51.14
I2S_SCLK  (via drill 0.3)
  Top 0.254: v24.92,41.54 24.92,40.67 C119.1 24.87,40.67 23.39,40.67 22.97,41.09 U12.6 | U6.35 74.2,58.33 71.09,55.23 71.09,51.77 71.5,51.37 v71.5,50.71
  Bottom 0.254: v24.92,41.54 27.25,41.54 28.4,42.68 62.38,42.68 70.23,50.53 71.32,50.53 v71.5,50.71
IO0
  Top 0.406: U6.27 77.98,48.17 R18.1 78.82,51.56 BOOT.2
IO1  (via drill 0.3)
  Top 0.305: U6.39 74.92,63.43 74.93,63.43 74.88,63.38 74.14,63.38 72.85,62.09 72.85,58.86 70.03,56.04 70.03,49.46 v71.25,48.24 | Q4.2 44.66,28.36 R36.1 46.71,28.38 48.16,29.83 v48.16,40.15
  Bottom 0.305: v71.25,48.24 63.17,40.16 48.55,40.16 v48.16,40.15
IO4  (via drill 0.3)
  Top 0.406: U6.4 56.42,60.87 v56.47,60.87 | v56.47,46.36 56.47,38.89 J1.5
  Bottom 0.406: v56.47,46.36 v56.47,60.87
IO5  (via drill 0.3)
  Top 0.406: J1.6 53.65,36.63 53.65,38.23 55.76,40.35 v55.76,46.36 | U6.5 v55.76,59.6
  Bottom 0.406: v55.76,46.36 v55.76,59.6
IO6  (via drill 0.3)
  Top 0.406: U6.6 57.37,58.35 v55.06,58.35 | J1.7 52.7,35.03 52.7,38.62 55.06,40.97 v55.06,46.36
  Bottom 0.406: v55.06,46.36 v55.06,58.35
IO7  (via drill 0.3)
  Top 0.406: U6.7 v54.36,57.06 | J1.8 51.84,33.36 51.84,39.02 52.34,39.52 52.63,39.81 54.36,41.54 v54.36,46.36
  Bottom 0.406: v54.36,46.36 v54.36,57.06
IO8
  Top 0.406: U6.12 52.78,50.71 48.67,46.59 42.93,46.59 31.12,34.78 31.12,34.02 J2.2
IO12/HMISO  (via drill 0.3)
  Top 0.406: R67.1 64.39,33.18 64.92,32.65 v65.51,32.65 66.19,32.65 | 66.19,32.65 66.6,32.65 | 66.6,32.65 66.95,32.65 | 66.95,32.65 67.4,32.65 D1.6 | TF1.7 66.58,32.62 66.6,32.65 | U6.20 v65.51,38.61 | 66.19,32.65 66.57,32.27 66.95,32.65
  Bottom 0.406: v65.51,38.61 v65.51,32.65
IO13/HMOSI  (via drill 0.3)
  Top 0.406: D1.3 v70.08,34.44 70.78,34.44 R31.1 | TF1.3 70.97,24.69 70.38,25.28 v70.38,31.5 | U6.21 v66.78,38.61
  Bottom 0.406: v70.38,31.5 70.38,34.13 v70.08,34.44 66.78,37.74 v66.78,38.61
IO15  (via drill 0.3)
  Top 0.305: 57.35,55.79 57.43,55.79 U6.8
  Top 0.406: 57.43,55.79 53.67,55.79 v53.66,55.8 | v53.66,46.36 53.66,41.93 51.11,39.38 v51.11,38.01 | U11.3 v56.19,20.2 57.12,21.14 R14.2
  Bottom 0.406: v53.66,46.36 v53.66,55.8 | v51.11,38.01 51.11,25.28 v56.19,20.2
IO16
  Top 0.406: U6.9 54.23,54.52 47.9,48.19 41.99,48.19 31.37,37.57 | J2.4 31.33,37.62 arc-90 31.37,37.57 | 31.37,37.57 29.67,37.57 arc-90 29.64,37.6
IO17
  Top 0.406: U6.10 54.13,53.25 48.26,47.38 42.37,47.38 30.2,35.21 30.07,35.08 J2.3
IO19
  Top 0.406: U6.13 54,49.44 53.7,49.44 52.66,49.44 48.97,45.75 43.59,45.75 | 43.59,45.75 43.38,45.75 43.36,45.75 31.97,34.36 31.97,28.98 30.79,27.8 30.58,27.59 29.52,26.53 R64.2 | 43.41,45.75 43.59,45.75
IO20
  Top 0.406: U6.14 54.05,48.17 53.52,48.17 52.63,48.17 49.38,44.91 43.81,44.91 32.84,33.94 32.84,28.71 31.57,27.44 29.95,25.81 13.64,25.81 12.9,25.08 12.65,25.08 R65.2
IO38/SCL  (via drill 0.3)
  Top 0.254: U1.7 49.45,20.15 U11.6 v50.49,20.2 | R1.2 C134.1 19.98,34.54 U12.1 19.98,39.66 v19.85,39.53 | U6.31 73.99,53.25 73.56,52.81 v73.56,49.86 | v49.81,36.96 49.81,40.04 v51.33,41.56
  Bottom 0.254: 51.46,41.46 62.79,41.46 70.84,49.51 73.21,49.51 v73.56,49.86 | 51.46,41.46 28.8,41.46 27.58,40.24 20.56,40.24 v19.85,39.53 | v49.81,36.96 49.81,20.89 v50.49,20.2 | v51.33,41.56 51.36,41.56 51.46,41.46
IO39/SDA  (via drill 0.3)
  Top 0.254: U1.8 47.77,20.65 48.59,21.47 U11.5 v50.42,21.47 | U12.19 18.57,41.49 18.39,41.31 18.39,39.76 | v72.92,50.44 72.92,53.4 73.97,54.44 74.81,54.44 U6.32 | 18.39,36.28 18.39,34.68 C133.1 | 18.39,36.28 18.39,39.76 | 18.39,39.76 v18.52,39.89 | R2.2 18.29,36.38 18.39,36.28 | v52.76,42.07 50.42,39.73 v50.42,37.5
  Top 0.305: 74.81,54.44 arc90 U6.32
  Bottom 0.254: 52.76,42.17 62.71,42.17 70.56,50.02 72.5,50.02 v72.92,50.44 | 52.76,42.17 28.7,42.17 27.28,40.75 19.38,40.75 v18.52,39.89 | v50.42,37.5 v50.42,21.47 | v52.76,42.07 52.76,42.17
IO40  (via drill 0.3)
  Top 0.254: U6.33 74.25,55.79 72.31,53.86 v72.31,48.9 | U12.2 20.38,39.02 v20.71,38.69 20.71,35.36 C118.1
  Bottom 0.254: v72.31,48.9 71.04,48.9 63.07,40.93 29.08,40.93 27.91,39.76 21.77,39.76 v20.71,38.69
IO45
  Top 0.406: U6.26 R76.2
IO46  (via drill 0.3)
  Top 0.254: U6.16 60.73,46.61 v60.73,44.81 | R164.2 v13.16,48.55
  Top 0.305: U20.1 12.59,49.7 R164.2
  Bottom 0.254: v60.73,44.81 22.21,44.81 19.53,47.48 14.15,47.48 13.16,48.47 v13.16,48.55
IO47/SPI_NCS2  (via drill 0.3)
  Top 0.406: D1.1 70.78,32.94 R71.1 71.22,32.49 v71.22,31.99 71.22,25.69 72.08,24.83 TF1.2 | U6.24 70.59,45.96 69.9,45.27 68.1,45.27 67.64,44.81 v67.64,38.61
  Bottom 0.406: v71.22,31.99 71.22,34.63 67.64,38.21 v67.64,38.61
IO48/SCLK  (via drill 0.3)
  Top 0.406: R32.1 v66.95,33.69 D1.5 | TF1.5 v68.78,30.12 v68.78,30.13 | U6.25 71.86,45.88 70.43,44.46 68.76,44.46 68.35,44.05 v68.35,39.35
  Bottom 0.406: 66.95,31.96 v66.95,33.69 | v68.78,30.13 66.95,31.96 | 66.95,31.96 65.13,31.96 64.74,32.34 64.74,39.05 65.05,39.35 v68.35,39.35
MICN
  Top 0.254: R163.2 C130.2 R162.1
MICP
  Top 0.61: C160.2 R152.1 C129.2
MKF_3V3  (via drill 0.3)  (1 unrouted)
  Top 0.254: R138.1 17.2,33.08 17.17,33.1 v16.41,33.1
  Top 0.61: C164.1 17.2,33.08 | v24.13,35.69 R136.1 | C32.2 7.64,37.19 | 7.64,37.19 C31.2 | U13.5 7.61,37.23 7.64,37.19 | C32.2 C161.2 v9.14,37.04 | MIC.1 7.64,37.32 C32.2 | 6.17,37.24 7.06,37.24 7.75,37.93 7.75,36.48 7.04,37.19 | 7.04,37.19 6.1,37.19 | 7.04,37.19 8.74,37.19 9.27,36.66 9.27,38.95 | 9.27,38.95 9.7,39.38 | 9.27,38.95 8.79,38.46 8.79,36.63 8.76,36.66 8.1,36.66 8.43,36.99 8.43,37.65
  Bottom 0.61: v9.14,37.04 14.53,37.04 | 14.53,37.04 15.19,37.04 | 15.19,37.04 15.85,37.04 | 15.85,37.04 22.78,37.04 v24.13,35.69 | v16.41,33.1 15.19,34.32 15.19,36.38 | 15.19,36.38 15.19,37.04 | 14.53,37.04 15.19,36.38 | 15.19,36.38 15.85,37.04
N$2
  Top 0.406: U4.2 17.25,18.24 16.87,18.63 16.54,18.96 R10.1
N$3  (via drill 0.3)
  Top 0.406: R11.2 v39.42,6.48 | U4.7 v26.06,18.24
  Bottom 0.406: v26.06,18.24 37.82,6.48 v39.42,6.48
N$4  (via drill 0.3)
  Top 0.406: R12.2 v39.55,4.73 | U4.6 v26.01,16.97
  Bottom 0.406: v26.01,16.97 38.25,4.73 v39.55,4.73
N$5
  Top 0.406: R16.1 39.62,30.46 C12.1 38.06,30.27 Q2.1
N$6
  Top 0.406: CHRG.C R11.1
N$7
  Top 0.406: DONE.C 37.16,4.76 R12.1
N$8
  Top 0.406: R15.2 R16.2 Q5.3
N$12
  Top 0.406: LED.C 78.98,32.39 R53.2
N$14  (via drill 0.3)
  Top 0.406: v39.93,24.37 R34.1 39.93,26.83 Q4.3 | LED1.3 v34.34,12.48
  Bottom 0.406: v34.34,12.48 33.66,13.16 33.66,19.41 38.61,24.37 v39.93,24.37
N$15
  Top 0.406: TF1.1 73.17,32.14 R33.1
N$16
  Top 0.406: TF1.8 65.47,30.75 62.87,33.36 R70.1
N$17  (via drill 0.3)
  Top 0.406: K1.3 41.96,49.51 | 41.92,49.46 41.61,49.46 41.3,49.16 | 41.96,49.51 41.92,49.46 | 41.96,49.51 42.24,49.51 | 42.24,49.51 K1.4 | 40.36,49.16 41.86,49.16 41.86,49.4 41.92,49.46 | v31.56,38.83 42.24,49.51 | v39.9,38.83 39.9,37 U3.4
  Bottom 0.406: v31.56,38.83 v39.9,38.83
N$18
  Top 0.406: Q5.1 44.64,31.06 R19.2 R17.1
N$19
  Top 0.406: U3.1 45.42,34.54 46.38,33.59 R17.2
N$20
  Top 0.305: R165.1 C145.2
N$22
  Top 0.406: LED1.1 36.76,10.46 37.87,11.56 38.59,11.56 LED2.3
N$24
  Top 0.406: LED2.1 40.95,10.46 42.06,11.56 42.84,11.56 LED3.3
N$27
  Top 0.305: R166.1 C147.2
N$28
  Top 0.61: SPK.2 10.45,58.01 C33.2 C149.2 R168.2
N$31
  Top 0.406: LED3.1 45.22,10.46 46.33,11.56 47.09,11.56 LED4.3
N$32
  Top 0.406: LED4.1 49.52,10.46 50.62,11.56 51.34,11.56 LED5.3
N$33
  Top 0.254: USB-NATIVE.A5 8.03,24.14 9.5,25.61 R74.2
N$34
  Top 0.254: USB-NATIVE.B5 9.98,21.8 11,22.82 R73.2
N$41
  Top 0.61: C163.1 C160.1 L5.2
N$42
  Top 0.254: U12.17 17.9,42.29 17.32,41.71 17.32,38.92 16.97,38.56 C130.1
N$43
  Top 0.305: 11.97,36.44 L5.1
  Top 0.61: C162.1 L5.1 | MIC.4 11.97,36.44
N$45
  Top 0.254: U12.12 21.18,45.62 C122.1 C125.1
N$47
  Top 0.254: U12.13 20.78,45.75 C123.1 C124.1
N$48
  Top 0.305: R134.1 19.74,49.31 18.82,48.39 C124.2
N$50
  Top 0.254: C125.2 23.32,49.21 R135.1
N$51
  Top 0.254: U12.18 18.26,41.89 17.83,41.46 17.83,38.41 17.12,37.7 16.13,37.7 C129.1
N$52  (1 unrouted)
  Top 0.254: U12.4 U12.3 20.78,39.5 20.87,39.42 | 20.87,39.42 21.89,38.39 | 20.78,40.65 21.16,40.65 21.16,39.76 21.5,39.42 | 21.5,39.42 22,38.92 21.67,38.92 20.96,39.63 20.96,40.5 | 20.87,39.42 21.5,39.42
  Top 0.61: R136.2 C131.1 C132.1
N$53  (via drill 0.3)
  Top 0.61: R152.2 13.56,37.24 v14.38,38.06 R162.2 | C135.1 14.38,46.06 | 14.38,46.06 14.91,46.06 | R140.2 15.21,46.06 15.19,46.06 14.91,46.06 | v14.38,45.52 14.38,46.06 | 13.74,46.01 13.89,46.01 v14.38,45.52 | v14.38,45.52 14.91,46.06
  Bottom 0.61: v14.38,38.06 v14.38,45.52
N$54
  Top 0.305: U20.2 15.01,51.17 C140.1
N$55
  Top 0.305: U20.6 5.3,51.82 4.78,51.29 C141.1 | 4.46,49.47 C143.1
  Top 0.61: C142.1 C143.1 C141.1 | FB5.1 4.46,49.47
N$56
  Top 0.61: U11.1 C74.1 57.5,15.2 Q19.P$1
N$57
  Top 0.61: U11.2 C75.1 Q19.P$2
N$58
  Top 0.61: R13.1 C73.2 C72.2
N$59
  Top 0.61: SPK.1 11.7,57.8 C33.1 C148.1 R167.2
OUTN
  Top 0.305: C147.1 R134.2 C146.1
OUTP  (via drill 0.3)
  Top 0.305: C145.1 C144.1 v18.87,49.56 | v20.93,49.56 21.44,49.56 R135.2
  Bottom 0.305: v18.87,49.56 v20.93,49.56
PA_INL+
  Top 0.305: U20.3 13.63,51.82 14.35,52.53 R165.2
PA_INL-
  Top 0.305: U20.4 13.02,52.47 14.58,54.03 R166.2
PA_OUTL+
  Top 0.305: R167.1 13.26,54.69 11.15,52.59 11.15,51.59 10.08,50.53 8.6,50.53 U20.8
PA_OUTL-
  Top 0.305: R168.1 U20.5
RESET  (via drill 0.3)
  Top 0.406: RST.2 78.75,58.08 C26.2 C36.1 v78.74,60.46 | R23.1 R63.1 54.99,62.14 U6.3 v68.07,62.14
  Bottom 0.406: v68.07,62.14 77.06,62.14 v78.74,60.46
USB_D+
  Top 0.254: 9.02,23.55 USB-NATIVE.A6 8.69,23.35 8.87,23.17 8.87,23.05 | 9.02,23.55 9.04,23.58 10.46,25 R65.1 | USB-NATIVE.B6 8.87,22.31 8.87,22.97 8.87,23.05 | 8.87,23.05 8.76,23.15 8.61,23.15 | 8.36,23.15 8.61,23.15 | 8.61,23.15 9.02,23.55 | 9.02,23.55 8.87,23.4 8.87,23.05
USB_D-
  Top 0.254: R64.1 11.02,26.4 8.38,23.76 USB-NATIVE.B7 6.78,22.82 6.4,22.56 6.4,22.05 6.91,21.75 USB-NATIVE.A7
V_BATT
  Top 0.254: U1.3 U1.2 45.42,20.05 45.42,19.9 | 44.36,19.9 44.98,19.9
  Top 0.61: 26.67,15.7 C20.1
  Top 0.813: C23.1 44.98,19.9 45.42,19.9 | Q1.3 29.43,18.9 28.63,18.09 | U4.5 26.52,15.7 C20.1
  Top 1.27: 28.63,17.66 28.63,18.09 D11.+ 29.05,19.07 30.03,19.07 | C23.1 36.19,19.9 BAT.1 32.18,19.07 30.03,19.07 | 26.67,15.7 30.03,19.07
VMID
  Top 0.254: U12.16 17.16,42.69 C128.1
VPWR  (via drill 0.3)
  Top 0.305: 42.88,23.04 42.65,23.27 | U2.1 | C29.2 | U13.1 | U2.3 v3.5,41.44 v3.5,41.43
  Top 0.61: U8.3 42.88,23.04 C11.2 42.88,23.32 42.88,24.14 43.67,24.94 U8.1 | FB5.2 3.05,46.46 C30.2 v3.5,45.07 U2.1 | U2.3 C29.2 | C29.2 C138.2 U13.1 | v3.5,32.6 C136.1 U13.3
  Top 0.813: C42.2 C15.2 32.56,12.05 v32.56,13.83 | C42.2 32.59,9.76 33.35,9 37.97,9 | 37.97,9 38.71,9 | 38.71,9 39.19,9 | 39.19,9 42.27,9 | 42.27,9 42.65,9 | 42.65,9 43.43,9 | 46.46,9 46.97,9 | 46.97,9 47.75,9 | 47.75,9 49.89,9 LED5.4 | LED4.4 47.1,9.13 46.97,9 | LED3.4 42.85,9.2 42.65,9 | LED2.4 38.6,9.11 38.71,9 | LED1.4 32.6,10.46 C42.2 | 37.97,9 38.58,9.61 39.19,9 | 42.27,9 42.85,9.58 43.43,9 | 43.43,9 46.46,9 | 46.46,9 47.09,9.63 47.12,9.63 47.75,9
  Top 1.016: C11.2 C17.2 39.22,23.32 37.54,25 | 37.11,25.84 v37.11,25.97 | v37.11,25.97 Q2.3 | v37.11,25.97 37.11,25.43 37.54,25 | R34.2 37.54,25
  Bottom 0.61: 34.34,25.94 35.13,25.15 35.92,25.94
  Bottom 0.813: v3.5,45.07 v3.5,41.43 v3.5,32.6 10.13,25.97 34.87,25.97 | v37.11,25.97 34.87,25.97 | v32.56,13.83 32.56,19.82 35.13,22.38 35.13,25.15 35.13,25.71 34.87,25.97
VRTC  (via drill 0.3)  (1 unrouted)
  Top 0.61: U3.5 C4.2
  Top 0.813: U11.8 C7.2 C71.2 R13.2 v43.31,17.66 | 34.98,28.9 36.35,30.26 C12.2 | 34.98,28.9 29.77,23.68 29.79,23.68 | Q2.2 34.98,28.9 | C12.2 36.35,29.12 36.09,28.86 | C12.2 R15.1 36.35,32.75 38.12,34.53 C4.2
  Top 1.016: D11.- 30.16,21.04 Q1.2 29.79,21 29.79,23.68 29.79,23.73 29.69,23.73 29.69,23.88 28.78,23.88 28.78,21.6 29.42,21.6 D4.C
  Bottom 0.813: v34.8,28.71 39.34,28.71 43.31,24.75 v43.31,17.66

### Text on the board
tPlace: Mic and Speaker | for Home Assistant V2.0 | - | + | www.makerfabs.com | J2 | J1 | GND | GND | 3V3 | 3V3 | + | -
bPlace: + | -
tNames: U3